# EAGLE design Iridium_9603_Beacon (EAGLE 9.2.2)

## Sheet 1 of 8
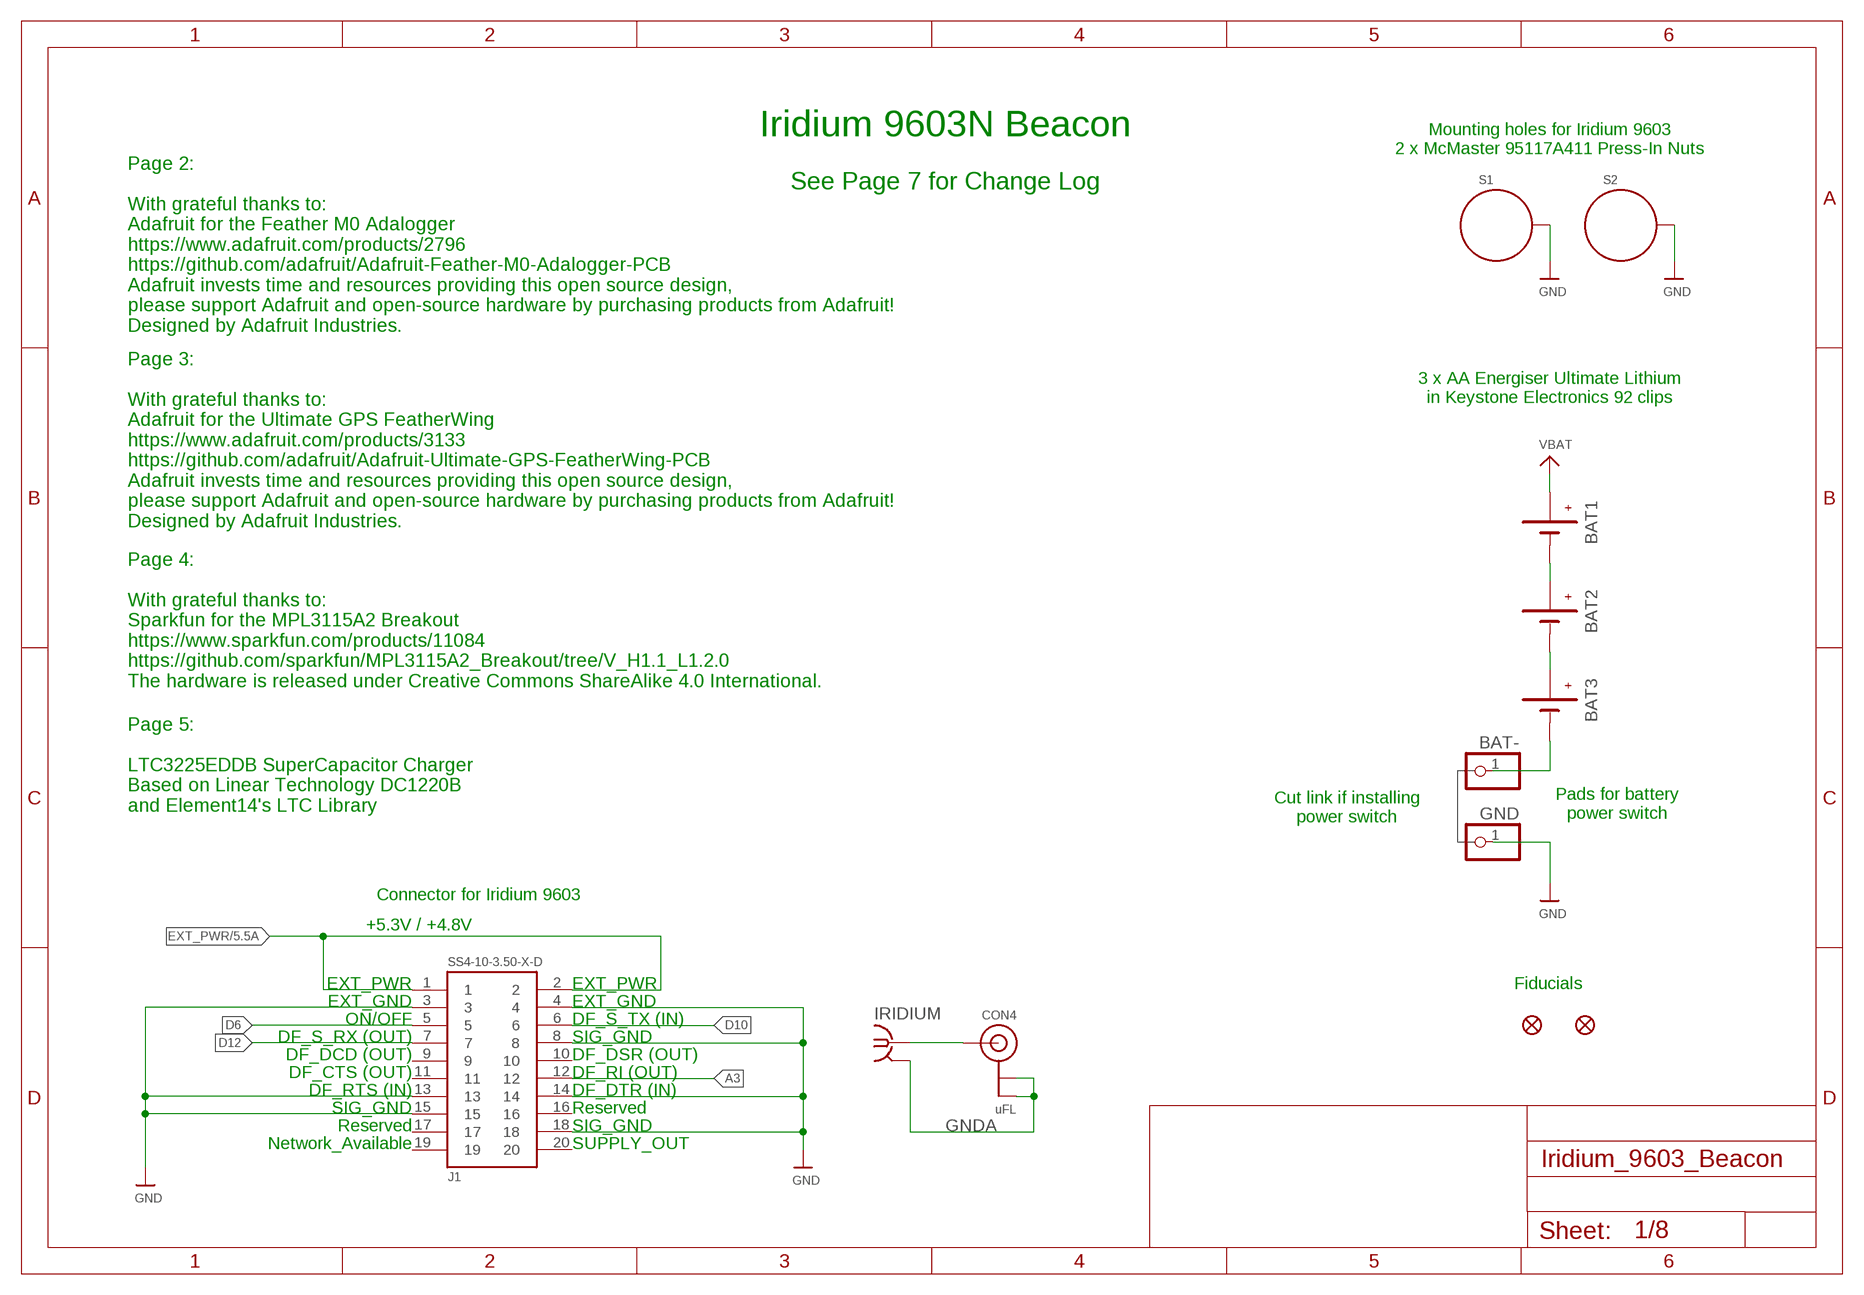
[diagram p0: schematic, sheet 1]

### Parts
BAT1  BATTERYKEYSTONE92  [BATTERY-AAA-KEYSTONE92]
BAT2  BATTERYKEYSTONE92  [BATTERY-AAA-KEYSTONE92]
BAT3  BATTERYKEYSTONE92  [BATTERY-AAA-KEYSTONE92]
BAT-  PINHD-1X1  [1X01]
CON4  uFL  ANTENNA_U.FL  [U.FL]
FD1  FIDUCIAL1X2  [FIDUCIAL-1X2]
FD2  FIDUCIAL1X2  [FIDUCIAL-1X2]
GND  PINHD-1X1  [1X01]
IRIDIUM  SMA-142-0711-821/826  [J502-ND-142-0711-821/826]
J1  SS4-10-3.50-X-D  [SS4-10-3.50-X-D]
S1  STANDOFF_ELECTRICALMCMASTER-95117A411  [STANDOFF-ELECTRICAL-MCMASTER-95117A411]
S2  STANDOFF_ELECTRICALMCMASTER-95117A411  [STANDOFF-ELECTRICAL-MCMASTER-95117A411]

### Nets
A3: J1.12 ; also sheet 2
D6: J1.5 ; also sheet 2
D10: J1.6 ; also sheet 2
D12: J1.7 ; also sheet 2
EXT_PWR: J1.1 J1.2 ; also sheet 5
GND: GND.1 J1.3 J1.4 J1.8 J1.13 J1.14 J1.15 J1.18 S1.P1 S2.P1 ; also sheet 2,3,4,5,6
GNDA: CON4.1(GND) CON4.2(GND) IRIDIUM.G@1 IRIDIUM.G@2 IRIDIUM.G@3 IRIDIUM.G@4
N$2: CON4.3(SIGNAL) IRIDIUM.1
N$8: BAT1.GND@1(-) BAT1.GND@2(-) BAT2.PWR@1(+) BAT2.PWR@2(+)
N$15: BAT3.GND@1(-) BAT3.GND@2(-) BAT-.1
N$21: BAT2.GND@1(-) BAT2.GND@2(-) BAT3.PWR@1(+) BAT3.PWR@2(+)
VBAT: BAT1.PWR@1(+) BAT1.PWR@2(+) ; also sheet 2
Unconnected: J1.9 J1.10 J1.11 J1.16 J1.17 J1.19 J1.20

### Notes on the sheet
- Iridium 9603N Beacon
- Mounting holes for Iridium 9603
  2 x McMaster 95117A411 Press-In Nuts
- See Page 7 for Change Log
- Page 2:
  
  With grateful thanks to:
  Adafruit for the Feather M0 Adalogger
  https://www.adafruit.com/products/2796
  https://github.com/adafruit/Adafruit-Feather-M0-Adalogger-PCB
  Adafruit invests time and resources providing this open source design,
  please support Adafruit and open-source hardware by purchasing products from Adafruit!
  Designed by Adafruit Industries.
- 3 x AA Energiser Ultimate Lithium
  in Keystone Electronics 92 clips
- Page 3:
  
  With grateful thanks to:
  Adafruit for the Ultimate GPS FeatherWing
  https://www.adafruit.com/products/3133
  https://github.com/adafruit/Adafruit-Ultimate-GPS-FeatherWing-PCB
  Adafruit invests time and resources providing this open source design,
  please support Adafruit and open-source hardware by purchasing products from Adafruit!
  Designed by Adafruit Industries.
- Page 4:
  
  With grateful thanks to:
  Sparkfun for the MPL3115A2 Breakout
  https://www.sparkfun.com/products/11084
  https://github.com/sparkfun/MPL3115A2_Breakout/tree/V_H1.1_L1.2.0
  The hardware is released under Creative Commons ShareAlike 4.0 International.
- Page 5:
  
  LTC3225EDDB SuperCapacitor Charger
  Based on Linear Technology DC1220B
  and Element14's LTC Library
- Pads for battery
  power switch
- Cut link if installing
  power switch
- Connector for Iridium 9603
- +5.3V / +4.8V
- EXT_PWR | EXT_PWR | Fiducials
- EXT_GND | EXT_GND
- ON/OFF | DF_S_TX (IN)
- DF_S_RX (OUT) | SIG_GND
- DF_DCD (OUT) | DF_DSR (OUT)
- DF_CTS (OUT) | DF_RI (OUT)
- DF_RTS (IN) | DF_DTR (IN)
- SIG_GND | Reserved
- Reserved | SIG_GND
- Network_Available | SUPPLY_OUT

## Sheet 2 of 8
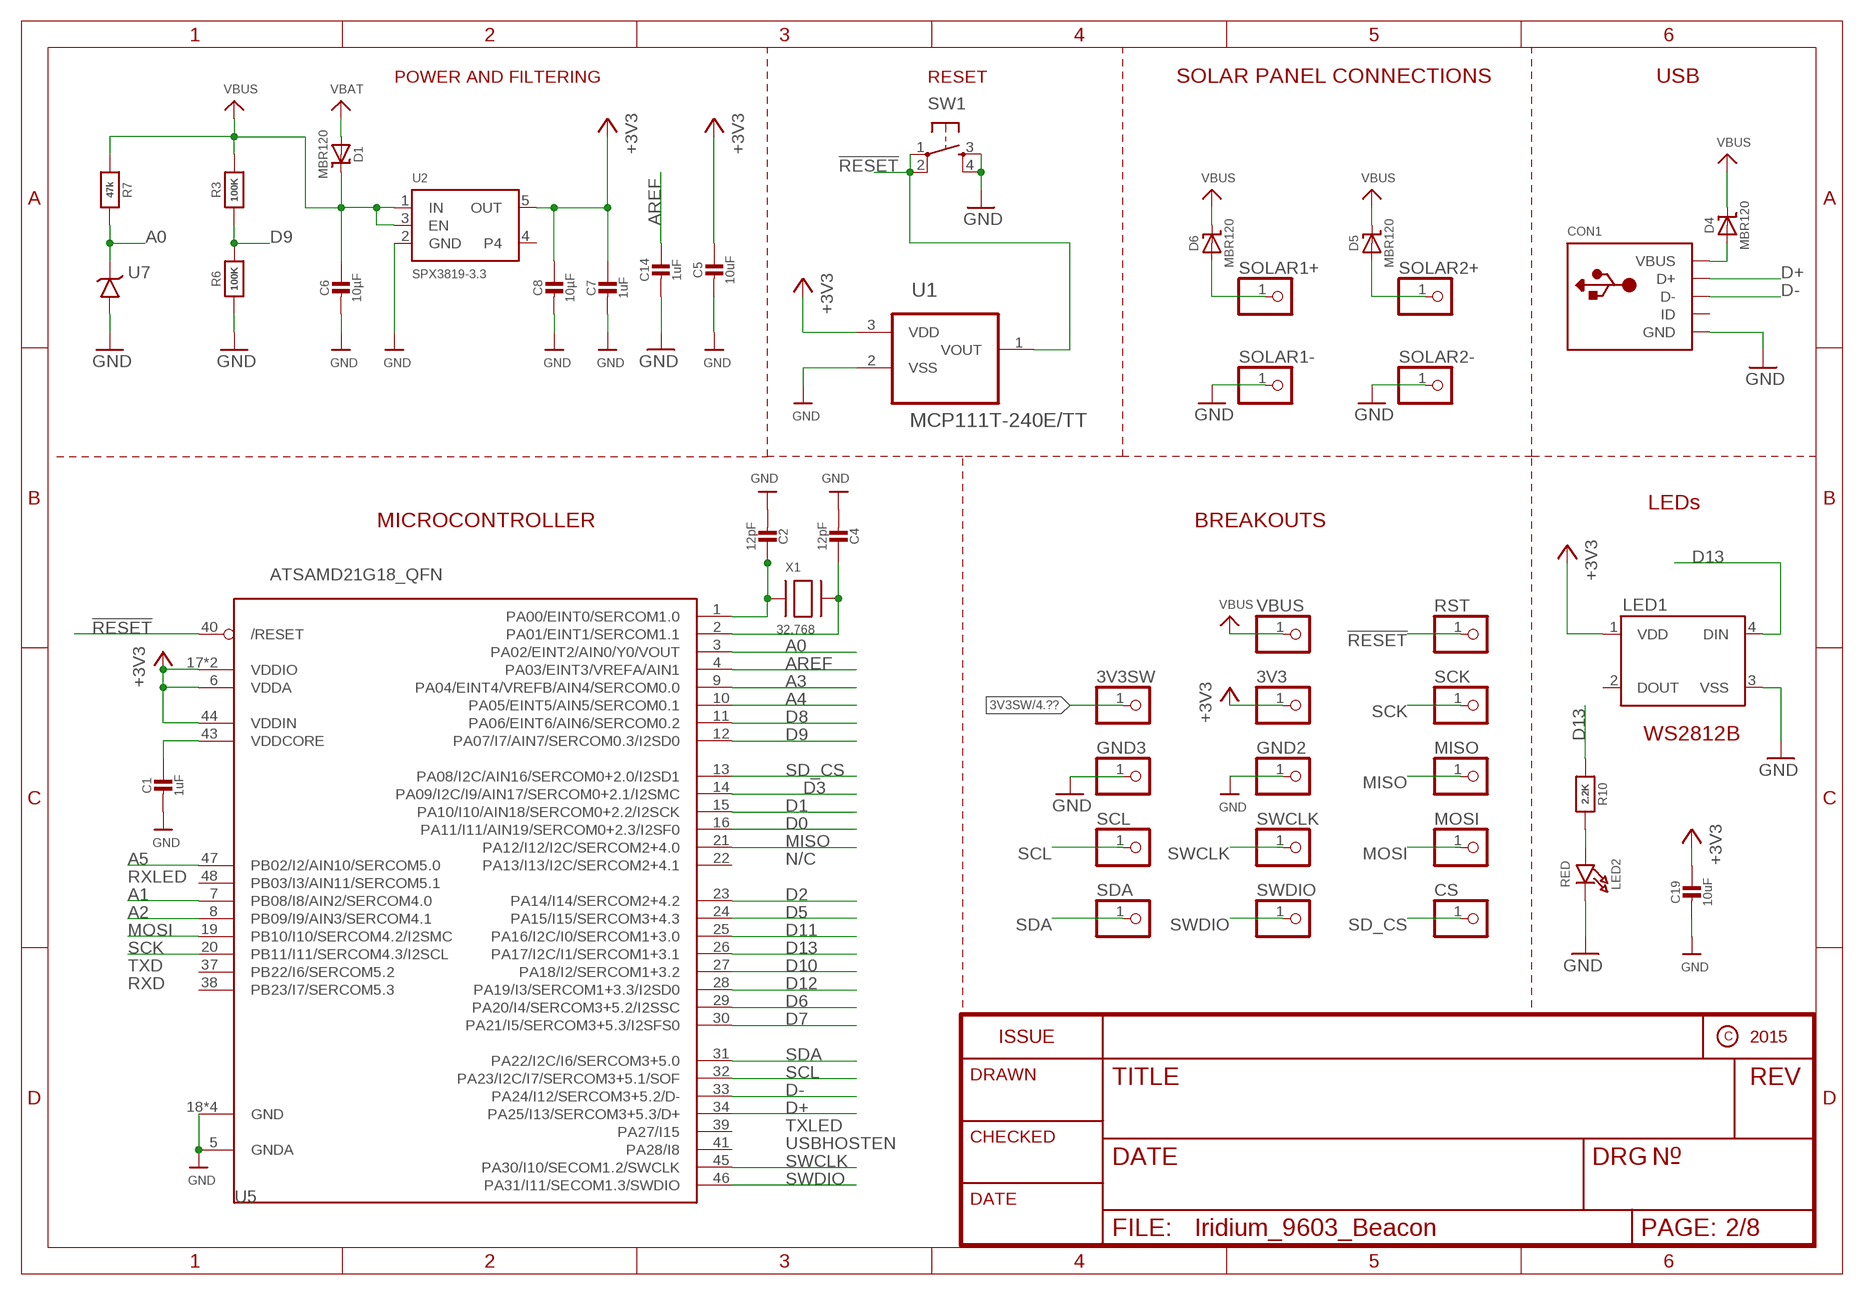
[diagram p1: schematic, sheet 2]

### Parts
3V3  PINHD-1X1  [1X01]
3V3SW  PINHD-1X1  [1X01]
C1  1uF  CAP_CERAMIC0603_NO  [0603-NO]
C2  12pF  CAP_CERAMIC0603_NO  [0603-NO]
C4  12pF  CAP_CERAMIC0603_NO  [0603-NO]
C5  10uF  CAP_CERAMIC0805-NOOUTLINE  [0805-NO]
C6  10µF  CAP_CERAMIC0805-NOOUTLINE  [0805-NO]
C7  1uF  CAP_CERAMIC0603_NO  [0603-NO]
C8  10µF  CAP_CERAMIC0805-NOOUTLINE  [0805-NO]
C14  1uF  CAP_CERAMIC0603_NO  [0603-NO]
C19  10uF  CAP_CERAMIC0805-NOOUTLINE  [0805-NO]
CON1  MICROBUILDER_USBFCI_10103594_CORRECTED  [MICROBUILDER_FCI_10103594_CORRECTED]
CS  PINHD-1X1  [1X01]
D1  MBR120  DIODE-SCHOTTKYSOD-123  [SOD-123]
D4  MBR120  DIODE-SCHOTTKYSOD-123  [SOD-123]
D5  MBR120  DIODE-SCHOTTKYSOD-123  [SOD-123]
D6  MBR120  DIODE-SCHOTTKYSOD-123  [SOD-123]
GND2  PINHD-1X1  [1X01]
GND3  PINHD-1X1  [1X01]
LED1  WS2812B  [WS2812B]
LED2  RED  LED0805_NOOUTLINE  [CHIPLED_0805_NOOUTLINE]
MISO  PINHD-1X1  [1X01]
MOSI  PINHD-1X1  [1X01]
R3  100K  RESISTOR0805_NOOUTLINE  [0805-NO]
R6  100K  RESISTOR0805_NOOUTLINE  [0805-NO]
R7  47k  RESISTOR_0603_NOOUT  [0603-NO]
R10  2.2K  RESISTOR_0603_NOOUT  [0603-NO]
RST  PINHD-1X1  [1X01]
SCK  PINHD-1X1  [1X01]
SCL  PINHD-1X1  [1X01]
SDA  PINHD-1X1  [1X01]
SOLAR1+  PINHD-1X1  [1X01]
SOLAR1-  PINHD-1X1  [1X01]
SOLAR2+  PINHD-1X1  [1X01]
SOLAR2-  PINHD-1X1  [1X01]
SW1  SWITCH_SPST_4_PINRECT  [TACTILE_SWITCH_SMD_4.6X2.8MM]
SWCLK  PINHD-1X1  [1X01]
SWDIO  PINHD-1X1  [1X01]
U1  MCP111T-240E/TT  MCP111T-270E/TT  [SOT95P237X112-3N]
U2  SPX3819-3.3  VREG_SOT23-5  [SOT23-5]
U5  ATSAMD21G18_QFN  ATSAMD21J_QFN  [TQFN48_7MM]
U7  LT1634-1,25BMCMS8  [MSOP8]
VBUS  PINHD-1X1  [1X01]
X1  32.768  XTAL-3.2X1.5  [XTAL3215]

### Nets
3V3SW: 3V3SW.1 ; also sheet 3,4
!RESET: RST.1 SW1.1 SW1.2 U1.1(VOUT) U5.40(/RESET)
+3V3: 3V3.1 C5.1 C7.1 C8.1 C19.1 LED1.1(VDD) U1.3(VDD) U2.5(OUT) U5.6(VDDA) U5.17(VDDIO) U5.36(VDDIO) U5.44(VDDIN) ; also sheet 3,4,5,6
A0: R7.2 U5.3(PA02/EINT2/AIN0/Y0/VOUT) U7.6(VOUT)
A1: U5.7(PB08/I8/AIN2/SERCOM4.0) ; also sheet 5
A2: U5.8(PB09/I9/AIN3/SERCOM4.1)
A3: U5.9(PA04/EINT4/VREFB/AIN4/SERCOM0.0) ; also sheet 1
A4: U5.10(PA05/EINT5/AIN5/SERCOM0.1)
A5: U5.47(PB02/I2/AIN10/SERCOM5.0) ; also sheet 5
AREF: C14.1 U5.4(PA03/EINT3/VREFA/AIN1)
D0: U5.16(PA11/I11/AIN19/SERCOM0+2.3/I2SF0) ; also sheet 3
D1: U5.15(PA10/I10/AIN18/SERCOM0+2.2/I2SCK) ; also sheet 3
D2: U5.23(PA14/I14/SERCOM2+4.2) ; also sheet 6
D3: U5.14(PA09/I2C/I9/AIN17/SERCOM0+2.1/I2SMC)
D5: U5.24(PA15/I15/SERCOM3+4.3) ; also sheet 5
D6: U5.29(PA20/I4/SERCOM3+5.2/I2SSC) ; also sheet 1
D7: U5.30(PA21/I5/SERCOM3+5.3/I2SFS0) ; also sheet 6
D8: U5.11(PA06/EINT6/AIN6/SERCOM0.2)
D9: R3.1 R6.2 U5.12(PA07/I7/AIN7/SERCOM0.3/I2SD0)
D10: U5.27(PA18/I2/SERCOM1+3.2) ; also sheet 1
D11: U5.25(PA16/I2C/I0/SERCOM1+3.0) ; also sheet 3
D12: U5.28(PA19/I3/SERCOM1+3.3/I2SD0) ; also sheet 1
D13: LED1.4(DIN) R10.1 U5.26(PA17/I2C/I1/SERCOM1+3.1)
D+: CON1.D+ U5.34(PA25/I13/SERCOM3+5.3/D+)
D-: CON1.D- U5.33(PA24/I12/SERCOM3+5.2/D-)
GND: C1.2 C2.2 C4.2 C5.2 C6.2 C7.2 C8.2 C14.2 C19.2 CON1.BASE@1(GND) CON1.BASE@2(GND) CON1.GND CON1.SPRT@1(GND) CON1.SPRT@2(GND) CON1.SPRT@3(GND) CON1.SPRT@4(GND) GND2.1 GND3.1 LED1.3(VSS) LED2.C R6.1 SOLAR1-.1 SOLAR2-.1 SW1.3 SW1.4 U1.2(VSS) U2.2(GND) U5.5(GNDA) U5.18(GND) U5.35(GND) U5.42(GND) U5.THERMAL(GND) U7.4(GND) ; also sheet 1,3,4,5,6
MISO: MISO.1 U5.21(PA12/I12/I2C/SERCOM2+4.0)
MOSI: MOSI.1 U5.19(PB10/I10/SERCOM4.2/I2SMC)
N$3: LED2.A R10.2
N$4: D6.A SOLAR1+.1
N$5: C2.1 U5.1(PA00/EINT0/SERCOM1.0) X1.P$1
N$7: C4.1 U5.2(PA01/EINT1/SERCOM1.1) X1.P$2
N$14: D5.A SOLAR2+.1
N$16: CON1.VBUS D4.A
SCK: SCK.1 U5.20(PB11/I11/SERCOM4.3/I2SCL)
SCL: SCL.1 U5.32(PA23/I2C/I7/SERCOM3+5.1/SOF) ; also sheet 4
SD_CS: CS.1 U5.13(PA08/I2C/AIN16/SERCOM0+2.0/I2SD1)
SDA: SDA.1 U5.31(PA22/I2C/I6/SERCOM3+5.0) ; also sheet 4
SWCLK: SWCLK.1 U5.45(PA30/I10/SECOM1.2/SWCLK)
SWDIO: SWDIO.1 U5.46(PA31/I11/SECOM1.3/SWDIO)
VBAT: D1.A ; also sheet 1
VBUS: C6.1 D1.C D4.C D5.C D6.C R3.2 R7.1 U2.1(IN) U2.3(EN) VBUS.1 ; also sheet 5
VDDCORE1: C1.1 U5.43(VDDCORE)
Unconnected: CON1.ID LED1.2(DOUT) U2.4 U5.22(PA13/I13/I2C/SERCOM2+4.1) U5.37(PB22/I6/SERCOM5.2) U5.38(PB23/I7/SERCOM5.3) U5.39(PA27/I15) U5.41(PA28/I8) U5.48(PB03/I3/AIN11/SERCOM5.1)

### Notes on the sheet
- POWER AND FILTERING | RESET | SOLAR PANEL CONNECTIONS | USB
- LEDs
- MICROCONTROLLER | BREAKOUTS
- WS2812B
- N/C
- RXLED
- TXD
- RXD
- TXLED
- USBHOSTEN

## Sheet 3 of 8
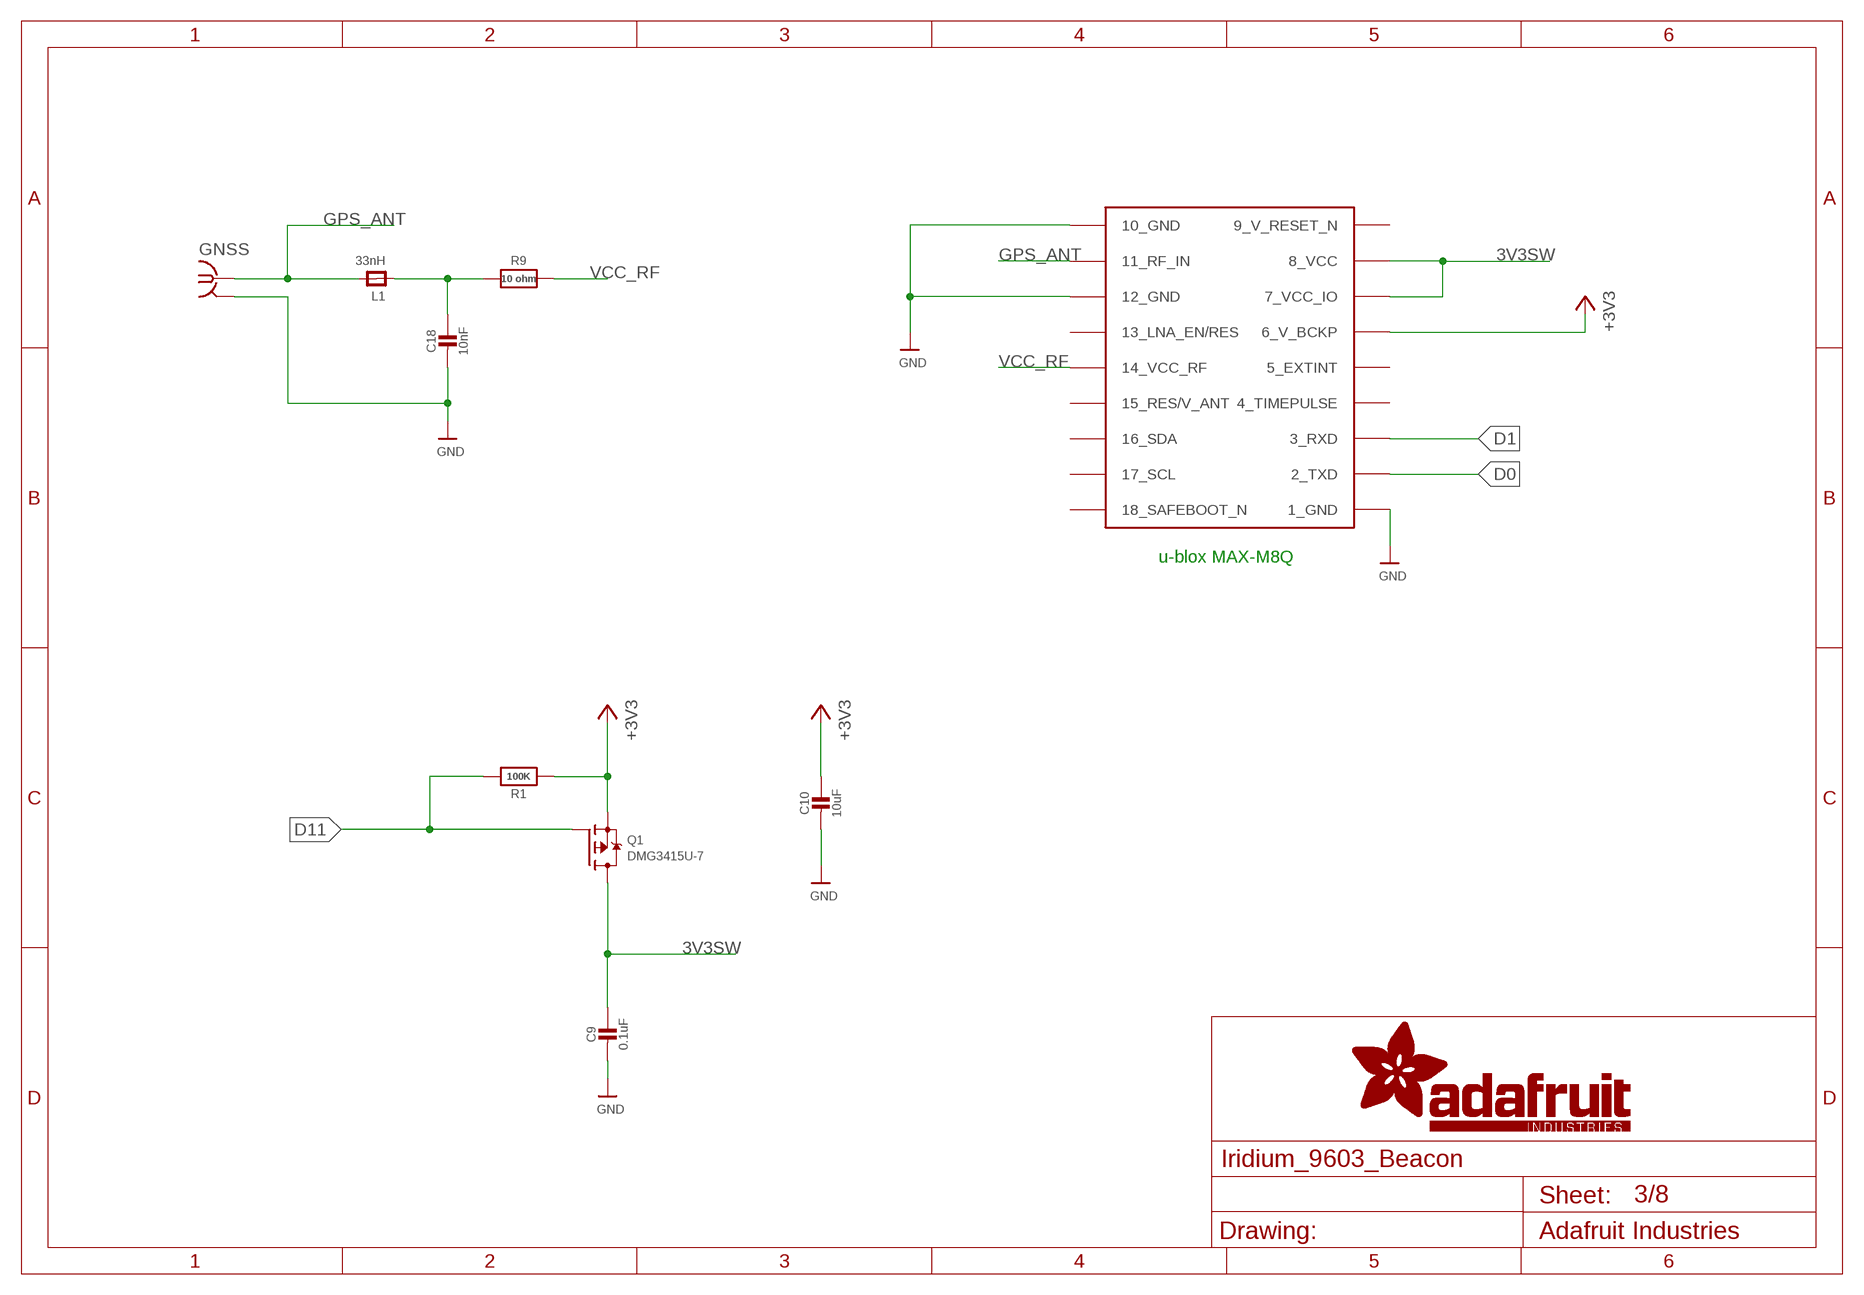
[diagram p2: schematic, sheet 3]

### Parts
C9  0.1uF  CAP_CERAMIC0805-NOOUTLINE  [0805-NO]
C10  10uF  CAP_CERAMIC0805-NOOUTLINE  [0805-NO]
C18  10nF  CAP_CERAMIC0805-NOOUTLINE  [0805-NO]
GNSS  SMA-142-0711-821/826  [J502-ND-142-0711-821/826]
L1  33nH  FERRITE-0805NO  [0805-NO]
Q1  DMG3415U-7  MOSFET-PWIDE  [SOT23-WIDE]
R1  100K  RESISTOR0805_NOOUTLINE  [0805-NO]
R9  10 ohm  RESISTOR0805_NOOUTLINE  [0805-NO]
U6  MAX-M8  [MAX-M8]

### Nets
3V3SW: C9.1 Q1.3(D) U6.7_VCC_IO U6.8_VCC ; also sheet 2,4
+3V3: C10.1 Q1.2(S) R1.1 U6.6_V_BCKP ; also sheet 2,4,5,6
D0: U6.2_TXD ; also sheet 2
D1: U6.3_RXD ; also sheet 2
D11: Q1.1(G) R1.2 ; also sheet 2
GND: C9.2 C10.2 C18.2 GNSS.G@1 GNSS.G@2 GNSS.G@3 GNSS.G@4 U6.1_GND U6.10_GND U6.12_GND ; also sheet 1,2,4,5,6
GPS_ANT: GNSS.1 L1.2 U6.11_RF_IN
N$1: C18.1 L1.1 R9.1
VCC_RF: R9.2 U6.14_VCC_RF
Unconnected: U6.4_TIMEPULSE U6.5_EXTINT U6.13_LNA_EN(13_LNA_EN/RES) U6.15_V_ANT/RESERVED(15_RES/V_ANT) U6.16_SDA U6.17_SCL U6.18_SAFEBOOT_N

### Notes on the sheet
- u-blox MAX-M8Q

## Sheet 4 of 8
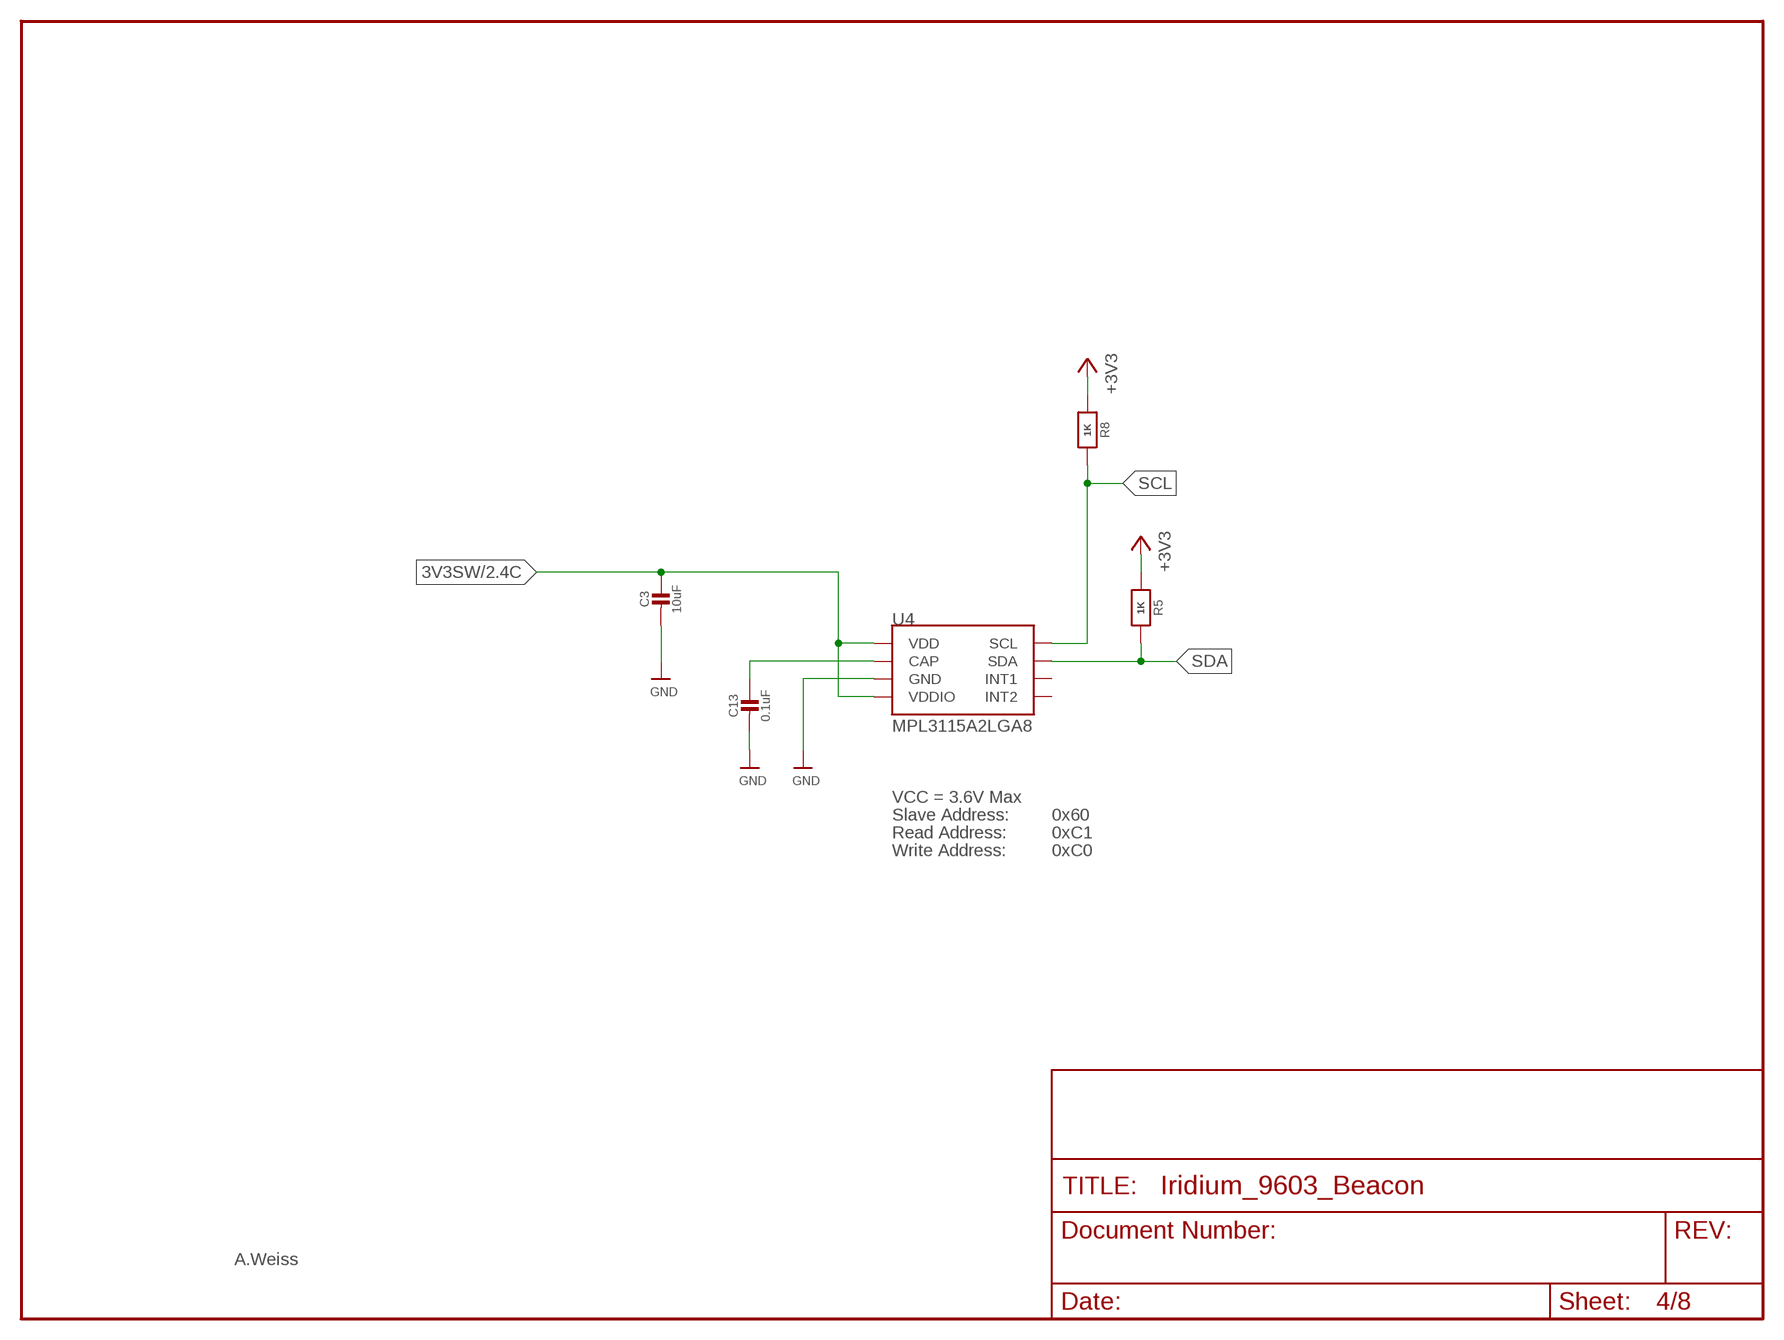
[diagram p3: schematic, sheet 4]

### Parts
C3  10uF  CAP_CERAMIC0805-NOOUTLINE  [0805-NO]
C13  0.1uF  CAP_CERAMIC0805-NOOUTLINE  [0805-NO]
R5  1K  RESISTOR_0603_NOOUT  [0603-NO]
R8  1K  RESISTOR_0603_NOOUT  [0603-NO]
U4  MPL3115A2LGA8  [LGA8]

### Nets
3V3SW: C3.1 U4.1(VDD) U4.4(VDDIO) ; also sheet 2,3
+3V3: R5.1 R8.1 ; also sheet 2,3,5,6
GND: C3.2 C13.2 U4.3(GND) ; also sheet 1,2,3,5,6
N$12: C13.1 U4.2(CAP)
SCL: R8.2 U4.8(SCL) ; also sheet 2
SDA: R5.2 U4.7(SDA) ; also sheet 2
Unconnected: U4.5(INT2) U4.6(INT1)

### Notes on the sheet
- VCC = 3.6V Max
- Slave Address: | 0x60
- Read Address: | 0xC1
- Write Address: | 0xC0
- A.Weiss

## Sheet 5 of 8
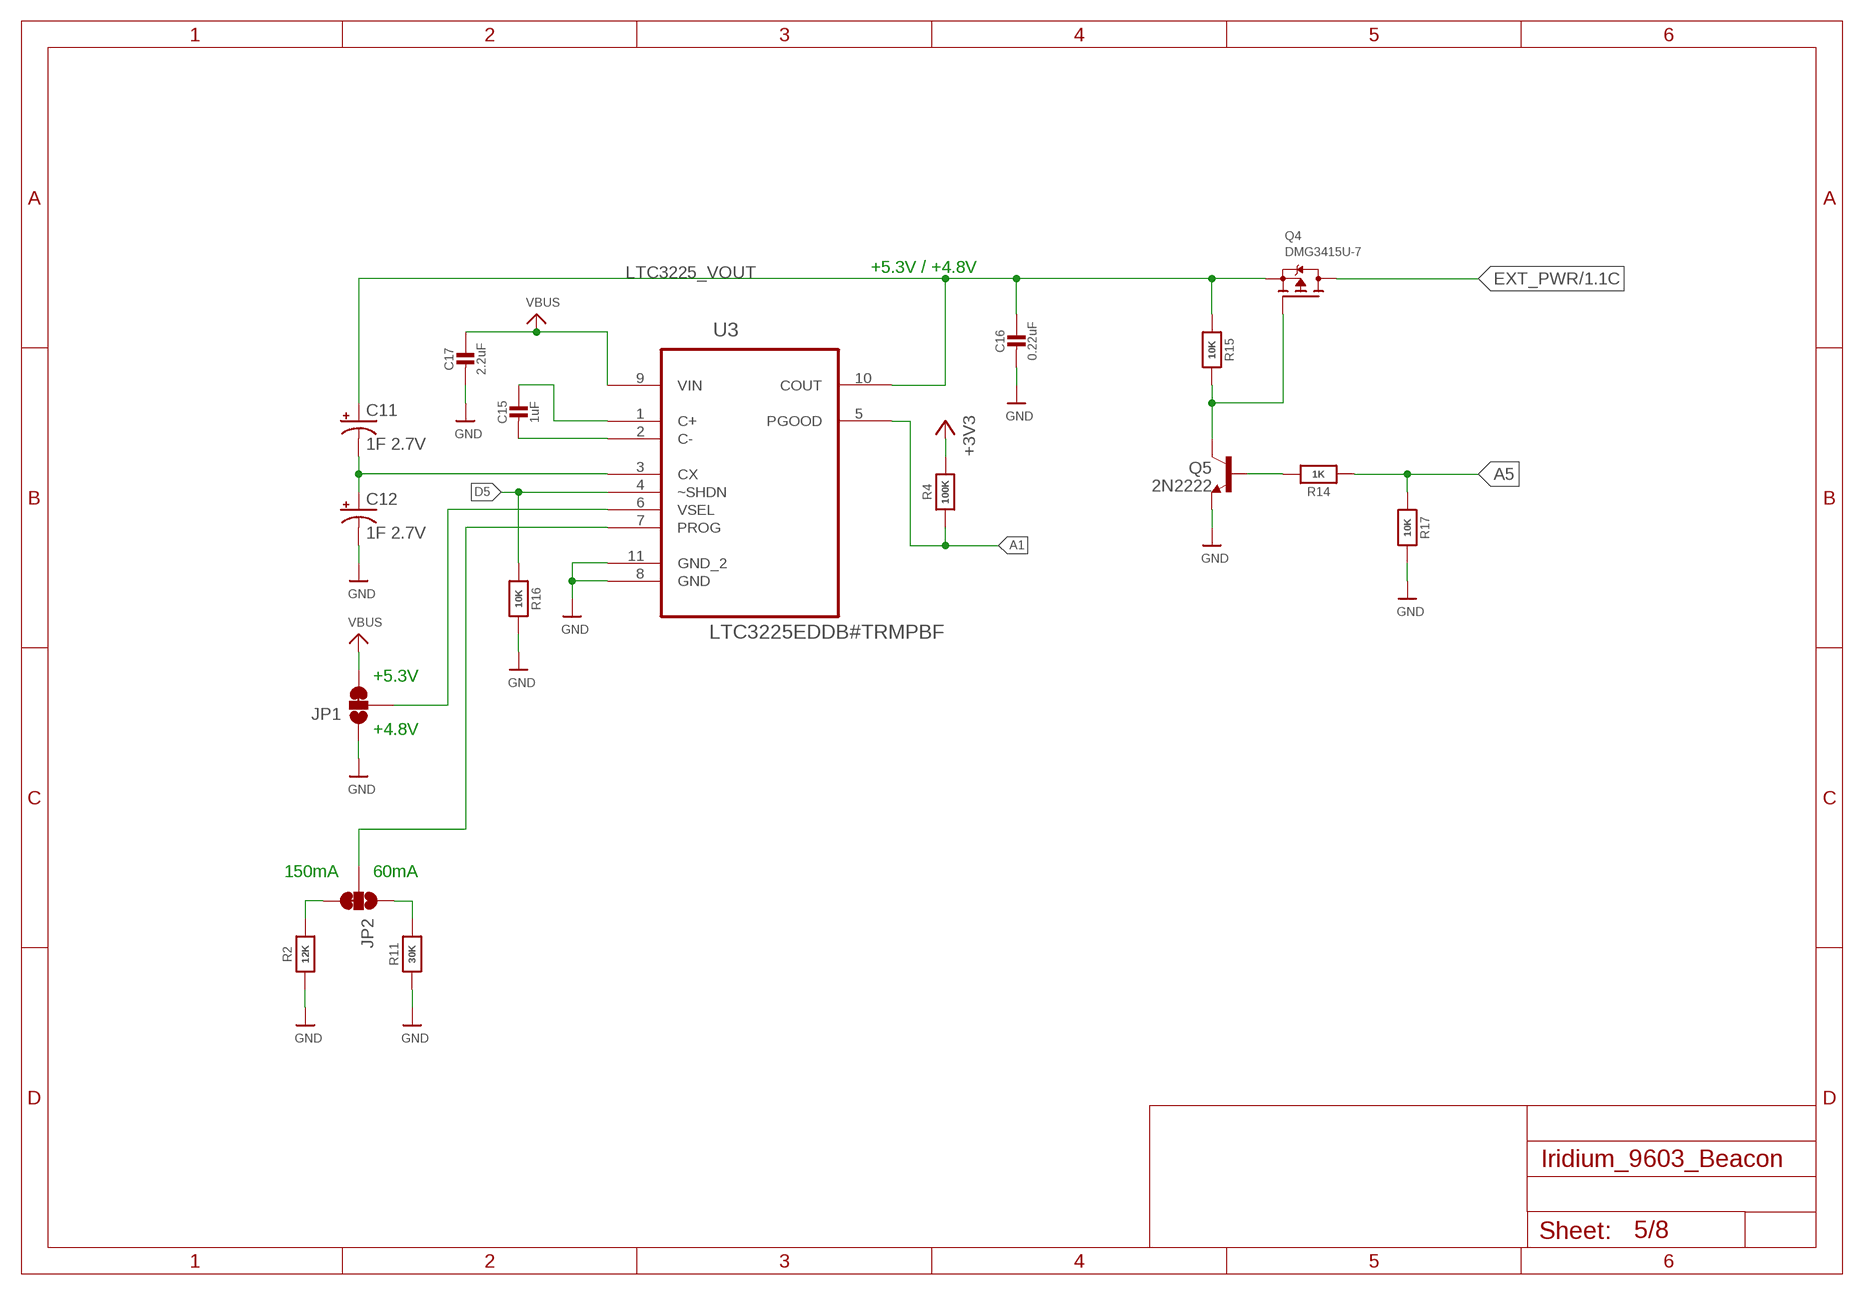
[diagram p4: schematic, sheet 5]

### Parts
C11  1F 2.7V  1F-2.7V(PTH)CPOL-RADIAL-1H-2.7V  [CPOL-RADIAL-1F-2.7V]
C12  1F 2.7V  1F-2.7V(PTH)CPOL-RADIAL-1H-2.7V  [CPOL-RADIAL-1F-2.7V]
C15  1uF  CAP_CERAMIC0603_NO  [0603-NO]
C16  0.22uF  CAP_CERAMIC0603_NO  [0603-NO]
C17  2.2uF  CAP_CERAMIC0805-NOOUTLINE  [0805-NO]
JP1  JUMPER-PAD-3-2OF3_NC_BY_TRACE_LARGE  [PAD-JUMPER-3-2OF3_NC_BY_TRACE_YES_SILK_LARGE]
JP2  JUMPER-PAD-3-2OF3_NC_BY_TRACE_LARGE  [PAD-JUMPER-3-2OF3_NC_BY_TRACE_YES_SILK_LARGE]
Q4  DMG3415U-7  MOSFET-PWIDE  [SOT23-WIDE]
Q5  2N2222  MMBT2222ALT1-NPN-SOT23-BEC  [SOT23-BEC]
R2  12K  RESISTOR0805_NOOUTLINE  [0805-NO]
R4  100K  RESISTOR0805_NOOUTLINE  [0805-NO]
R11  30K  RESISTOR0805_NOOUTLINE  [0805-NO]
R14  1K  RESISTOR_0603_NOOUT  [0603-NO]
R15  10K  RESISTOR_0603_NOOUT  [0603-NO]
R16  10K  RESISTOR_0603_NOOUT  [0603-NO]
R17  10K  RESISTOR_0603_NOOUT  [0603-NO]
U3  LTC3225EDDB#TRMPBF  LTC3225EDDB-TRMPBFDFN300X200-10L  [DFN300X200-10L]

### Nets
+3V3: R4.2 ; also sheet 2,3,4,6
A1: R4.1 U3.5(PGOOD) ; also sheet 2
A5: R14.1 R17.1 ; also sheet 2
D5: R16.1 U3.4(~SHDN) ; also sheet 2
EXT_PWR: Q4.3(D) ; also sheet 1
GND: C12.- C16.2 C17.2 JP1.1 Q5.E R2.1 R11.1 R16.2 R17.2 U3.8(GND) U3.11(GND_2) ; also sheet 1,2,3,4,6
LTC3225_VOUT: C11.+ C16.1 Q4.2(S) R15.1 U3.10(COUT)
N$6: C11.- C12.+ U3.3(CX)
N$9: C15.2 U3.2(C-)
N$10: C15.1 U3.1(C+)
N$11: JP2.2 U3.7(PROG)
N$13: JP1.2 U3.6(VSEL)
N$17: JP2.3 R2.2
N$18: JP2.1 R11.2
N$19: Q4.1(G) Q5.C R15.2
N$20: Q5.B R14.2
VBUS: C17.1 JP1.3 U3.9(VIN) ; also sheet 2

### Notes on the sheet
- +5.3V / +4.8V
- +5.3V
- +4.8V
- 150mA | 60mA

## Sheet 6 of 8
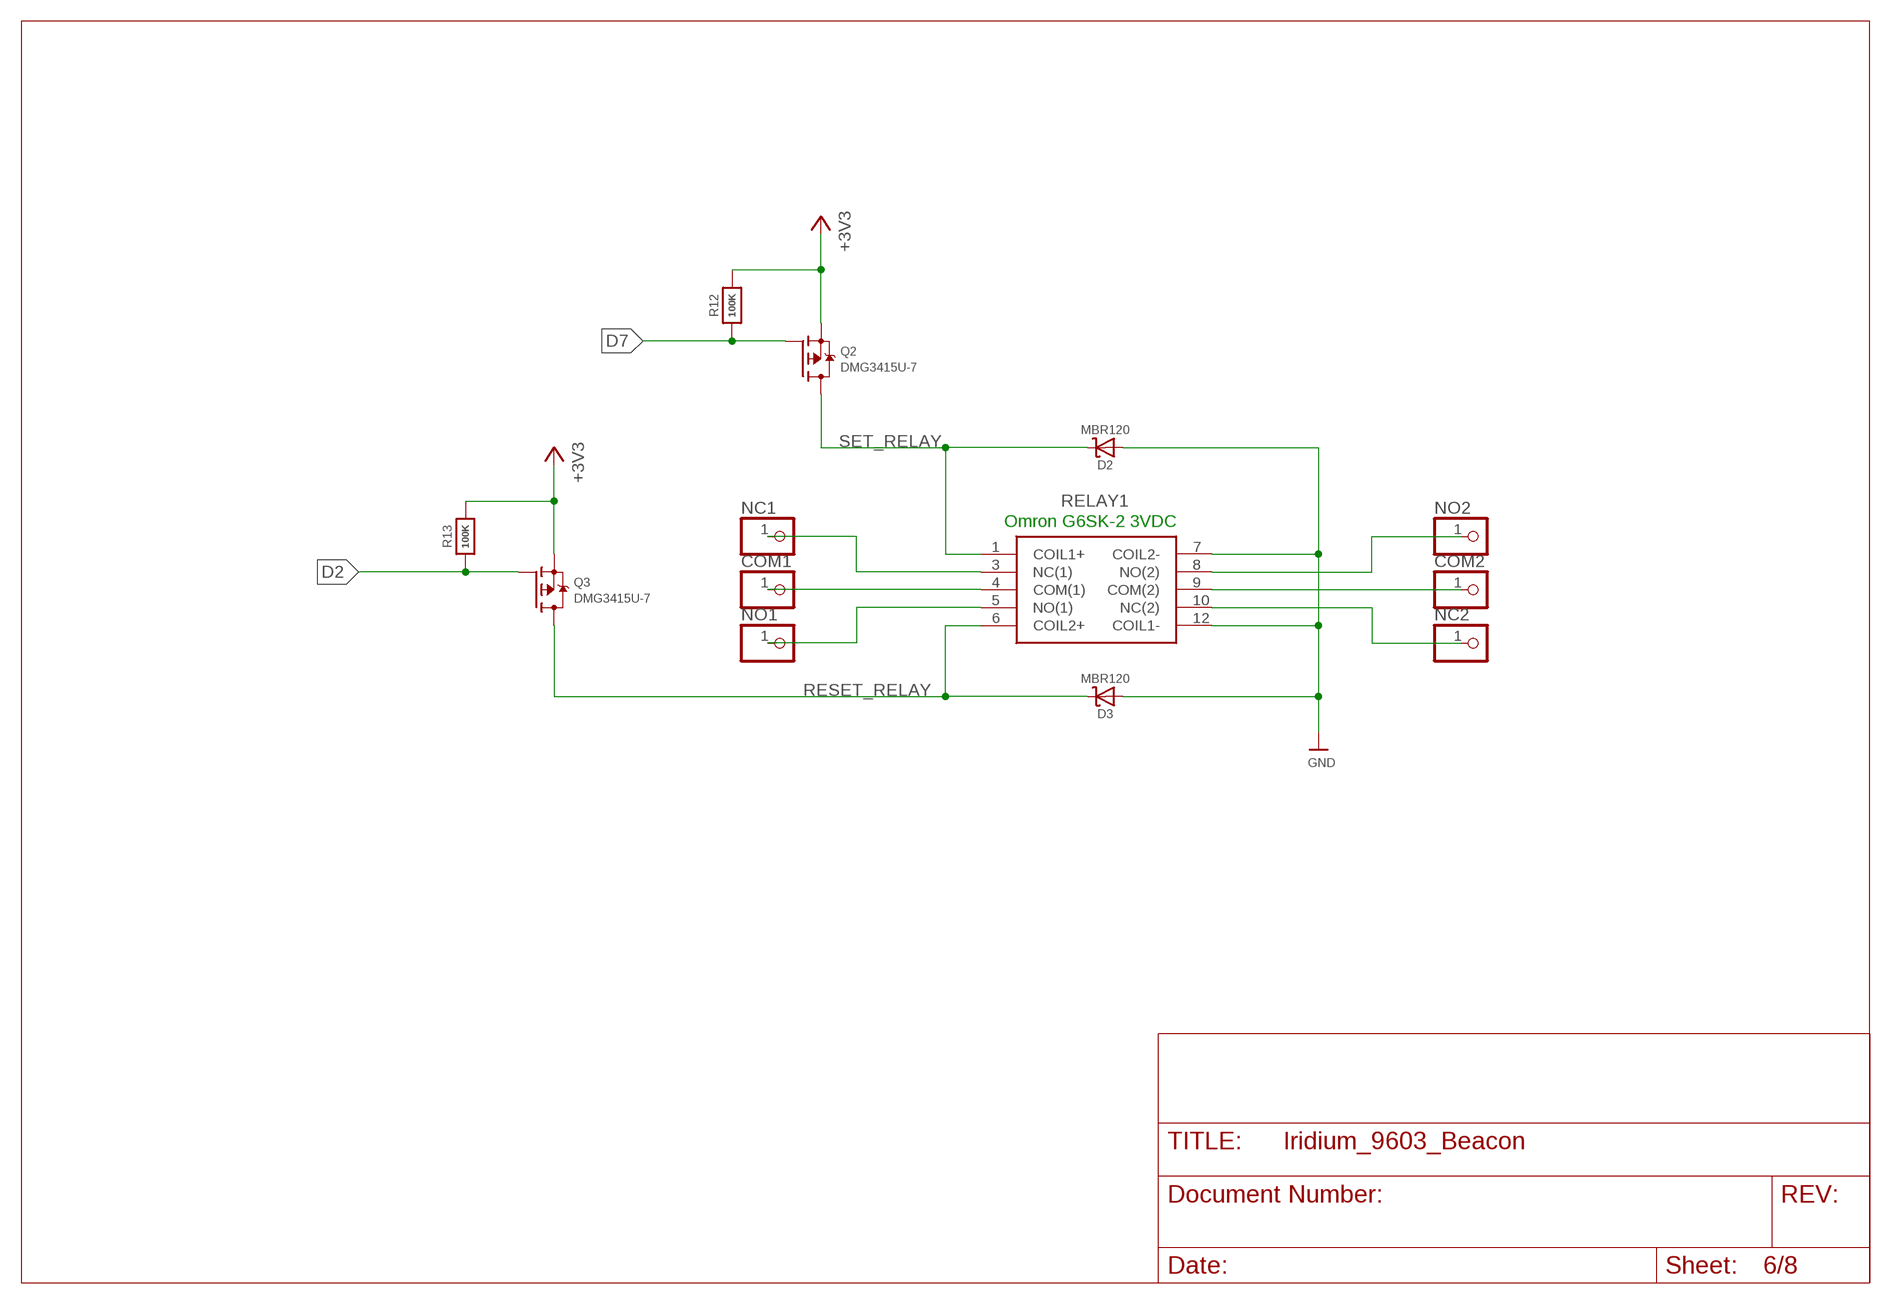
[diagram p5: schematic, sheet 6]

### Parts
COM1  PINHD-1X1  [1X01]
COM2  PINHD-1X1  [1X01]
D2  MBR120  DIODE-SCHOTTKYSOD-123  [SOD-123]
D3  MBR120  DIODE-SCHOTTKYSOD-123  [SOD-123]
NC1  PINHD-1X1  [1X01]
NC2  PINHD-1X1  [1X01]
NO1  PINHD-1X1  [1X01]
NO2  PINHD-1X1  [1X01]
Q2  DMG3415U-7  MOSFET-PWIDE  [SOT23-WIDE]
Q3  DMG3415U-7  MOSFET-PWIDE  [SOT23-WIDE]
R12  100K  RESISTOR0805_NOOUTLINE  [0805-NO]
R13  100K  RESISTOR0805_NOOUTLINE  [0805-NO]
RELAY1  G6SK-2_DC5  [G6SK2DC5]

### Nets
+3V3: Q2.2(S) Q3.2(S) R12.2 R13.2 ; also sheet 2,3,4,5
D2: Q3.1(G) R13.1 ; also sheet 2
D7: Q2.1(G) R12.1 ; also sheet 2
GND: D2.A D3.A RELAY1.7(COIL2-) RELAY1.12(COIL1-) ; also sheet 1,2,3,4,5
N$23: NC1.1 RELAY1.3(NC(1))
N$24: COM1.1 RELAY1.4(COM(1))
N$25: NO1.1 RELAY1.5(NO(1))
N$26: NO2.1 RELAY1.8(NO(2))
N$27: COM2.1 RELAY1.9(COM(2))
N$28: NC2.1 RELAY1.10(NC(2))
RESET_RELAY: D3.C Q3.3(D) RELAY1.6(COIL2+)
SET_RELAY: D2.C Q2.3(D) RELAY1.1(COIL1+)

### Notes on the sheet
- Omron G6SK-2 3VDC

## Sheet 7 of 8
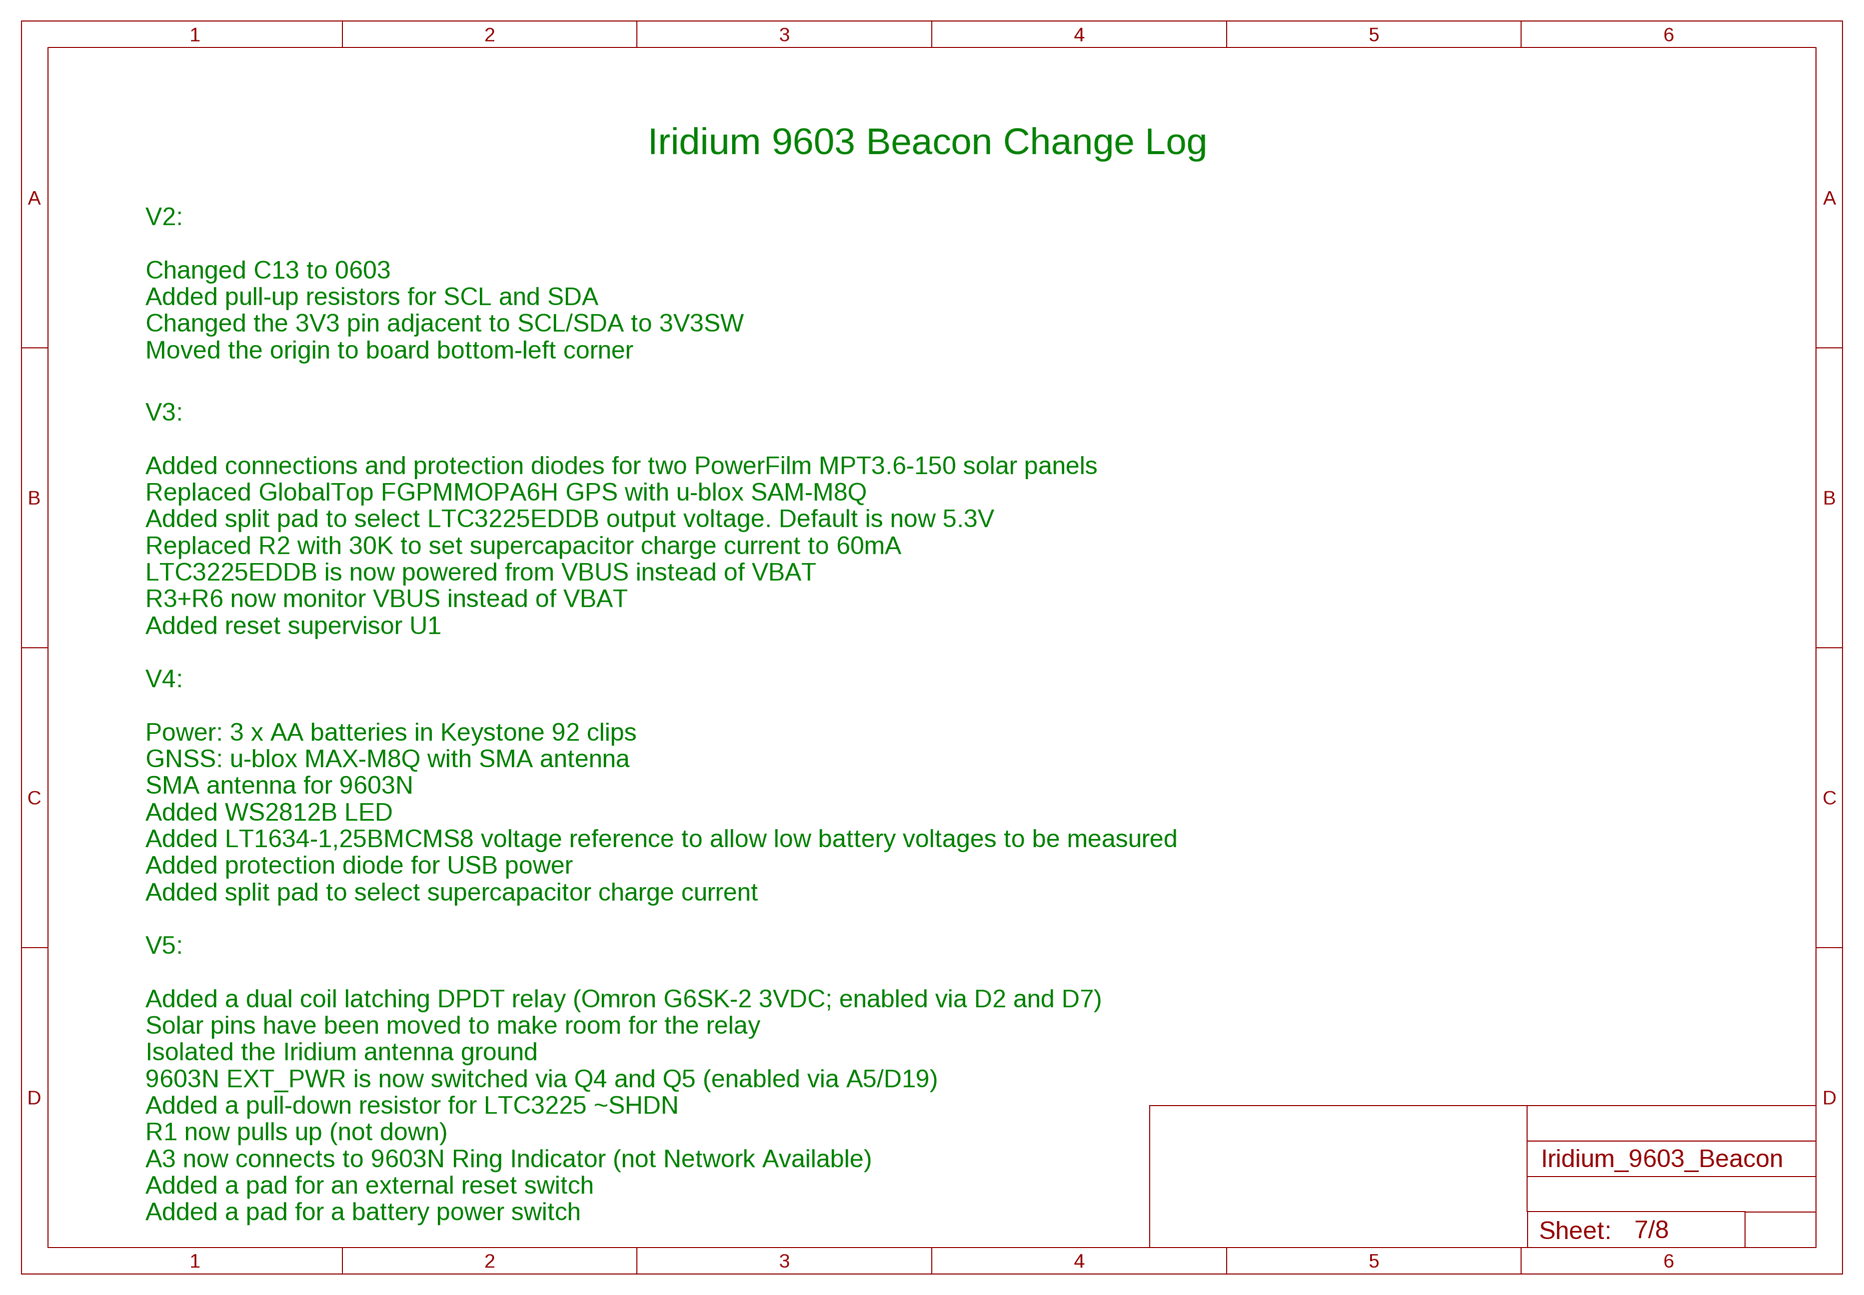
[diagram p6: schematic, sheet 7]

### Notes on the sheet
- Iridium 9603 Beacon Change Log
- V2:
  
  Changed C13 to 0603
  Added pull-up resistors for SCL and SDA
  Changed the 3V3 pin adjacent to SCL/SDA to 3V3SW
  Moved the origin to board bottom-left corner
- V3:
  
  Added connections and protection diodes for two PowerFilm MPT3.6-150 solar panels
  Replaced GlobalTop FGPMMOPA6H GPS with u-blox SAM-M8Q
  Added split pad to select LTC3225EDDB output voltage. Default is now 5.3V
  Replaced R2 with 30K to set supercapacitor charge current to 60mA
  LTC3225EDDB is now powered from VBUS instead of VBAT
  R3+R6 now monitor VBUS instead of VBAT
  Added reset supervisor U1
- V4:
  
  Power: 3 x AA batteries in Keystone 92 clips
  GNSS: u-blox MAX-M8Q with SMA antenna
  SMA antenna for 9603N
  Added WS2812B LED
  Added LT1634-1,25BMCMS8 voltage reference to allow low battery voltages to be measured
  Added protection diode for USB power
  Added split pad to select supercapacitor charge current
- V5:
  
  Added a dual coil latching DPDT relay (Omron G6SK-2 3VDC; enabled via D2 and D7)
  Solar pins have been moved to make room for the relay
  Isolated the Iridium antenna ground
  9603N EXT_PWR is now switched via Q4 and Q5 (enabled via A5/D19)
  Added a pull-down resistor for LTC3225 ~SHDN
  R1 now pulls up (not down)
  A3 now connects to 9603N Ring Indicator (not Network Available)
  Added a pad for an external reset switch
  Added a pad for a battery power switch

## Sheet 8 of 8
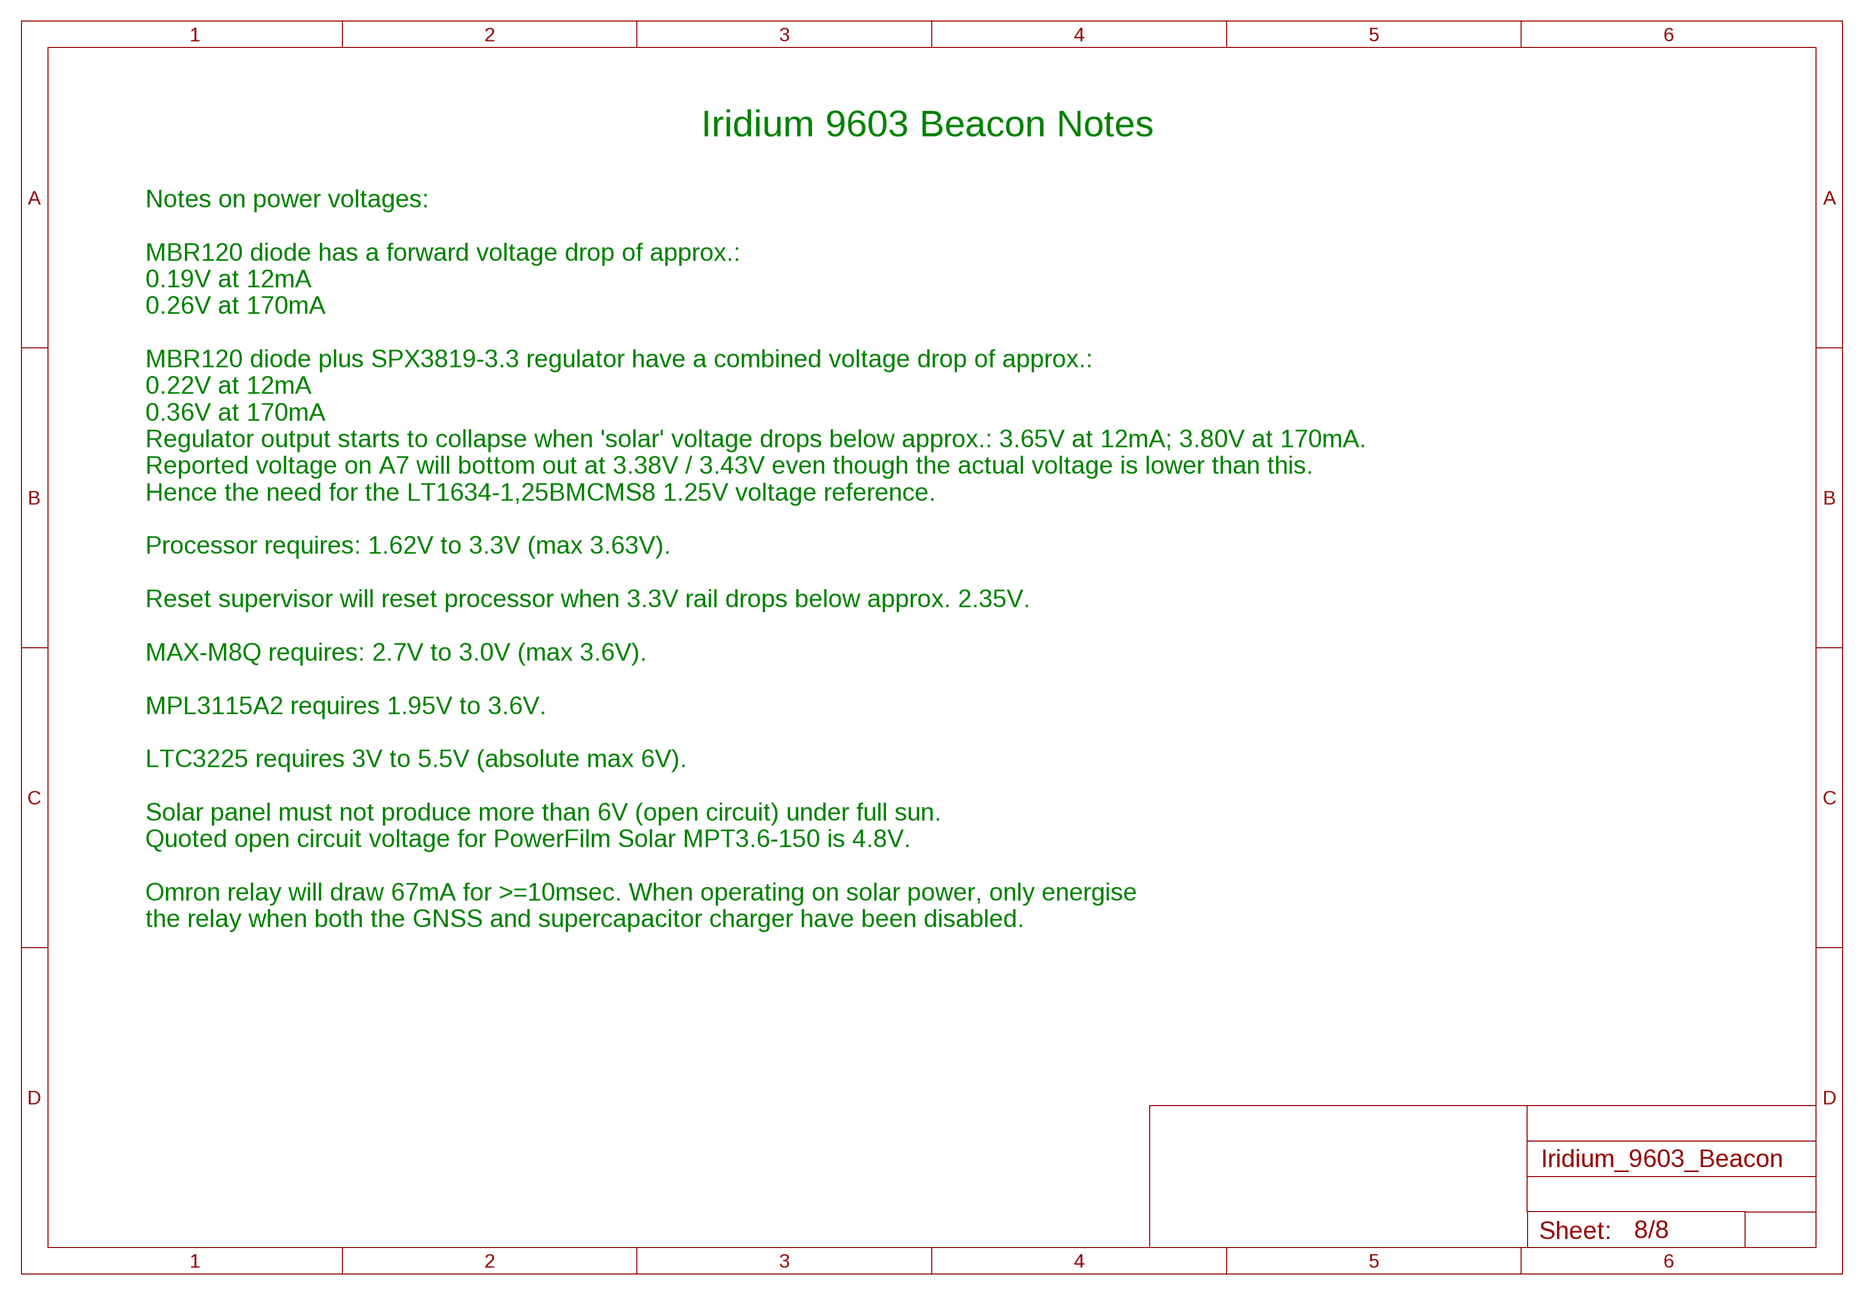
[diagram p7: schematic, sheet 8]

### Notes on the sheet
- Iridium 9603 Beacon Notes
- Notes on power voltages:
  
  MBR120 diode has a forward voltage drop of approx.:
  0.19V at 12mA
  0.26V at 170mA
  
  MBR120 diode plus SPX3819-3.3 regulator have a combined voltage drop of approx.:
  0.22V at 12mA
  0.36V at 170mA
  Regulator output starts to collapse when 'solar' voltage drops below approx.: 3.65V at 12mA; 3.80V at 170mA.
  Reported voltage on A7 will bottom out at 3.38V / 3.43V even though the actual voltage is lower than this.
  Hence the need for the LT1634-1,25BMCMS8 1.25V voltage reference.
  
  Processor requires: 1.62V to 3.3V (max 3.63V).
  
  Reset supervisor will reset processor when 3.3V rail drops below approx. 2.35V.
  
  MAX-M8Q requires: 2.7V to 3.0V (max 3.6V).
  
  MPL3115A2 requires 1.95V to 3.6V.
  
  LTC3225 requires 3V to 5.5V (absolute max 6V). 
  
  Solar panel must not produce more than 6V (open circuit) under full sun.
  Quoted open circuit voltage for PowerFilm Solar MPT3.6-150 is 4.8V.
  
  Omron relay will draw 67mA for >=10msec. When operating on solar power, only energise
  the relay when both the GNSS and supercapacitor charger have been disabled.

## Power pins joined to a net without a drawn wire
9_V_RESET_N: U6.9_RESET_N(9_V_RESET_N)

## Library data of the parts
3V3 3V3SW BAT- COM1 COM2 CS GND GND2 GND3 MISO MOSI NC1 NC2 NO1 NO2 RST SCK SCL SDA SOLAR1+ SOLAR1- SOLAR2+ SOLAR2- SWCLK SWDIO VBUS = adafruit:PINHD-1X1: Pin header 1x1 for 0.1" spacing With round pins
BAT1-BAT3 = SparkFun-Electromechanical:BATTERY: Battery Holders Various common sizes : AA, AAA, 18650 (PRT-12895), 20mm coin cell and 12mm coin cell. 20MM_4LEGS, BATT-10373
C1-C10 C13-C19 = microbuilder:CAP_CERAMIC: Ceramic Capacitors For new designs, use the packages preceded by an '_' character since they are more reliable: The following footprints should be used on most boards: _0402 - Standard footprint for regular board layouts _0603 - Standard footprint for regular board layouts _0805 - Standard footprint for regular board layouts _1206 - Standard footprint for regular board layouts For extremely tight-pitch boards where space is at a premium, the following 'micro-pitch' footprints can be used (smaller pads, no silkscreen outline, etc.): _0402MP - Micro-pitch footprint for very dense/compact boards _0603MP - Micro-pitch footprint for very dense/compact boards _0805MP - Micro-pitch footprint for very dense/compact boards _1206MP - Micro-pitch footprint for very dense/compact boards
C11 C12 = SparkFun-Capacitors:1F-2.7V(PTH): CAP-08070
CON1 = Iridium_9603_Beacon:MICROBUILDER_USB: USB Connectors USBMINIB - Surface Mount Female Mini-B USB Connector 4UConnector: 06564
CON4 = microbuilder:ANTENNA_U.FL: U.FL Antenna Connector
D1-D6 = microbuilder:DIODE-SCHOTTKY
FD1 FD2 = SparkFun-Aesthetics:FIDUCIAL: Fiducial Alignment Points Various fiducial points for machine vision alignment.
GNSS IRIDIUM = con-coax:SMA-: SMA 50 Ohm End Launch Jack Receptacle - Round Contact Johnson Components Source: www.johnsoncomponents.com .. J502-ND.pdf; MF: JOHNSON COMPONENTS; MPN: 142-0711-821; OC_FARNELL: 1019328; OC_NEWARK: 16F3627
J1 = SS4-10-3.50-X-D:SS4-10-3.50-X-D: 0.4mm[.016] SOCKET STRIP ASSEMBLY.
JP1 JP2 = SparkFun-Passives:JUMPER-PAD-3-2OF3_NC_BY_TRACE
L1 = microbuilder:FERRITE: Ferrite Bead 0603 MMZ1608B121C - 120 Ohm @ 100MHz, 600mA, 0.15 Ohm DC Resistance - Digikey: 445-2164-1-ND BK1608HW121-T - 120 Ohm, 600mA Ferrite Chip - Digikey: 587-1876-2-ND 0805 HZ0805B272R-10 - 2.7K Ohm @ 100MHz, 200mA, 0.8 Ohm DC Resistance - Digikey: 240-2504-1-ND (see also Murata BLM21BD272SN1L) MMZ2012Y152B - 1.5K Ohm @ 100MHz, 500mA, 0.4 Ohm DC Resistance - Digikey: 445-1560-1-ND - Mainly for high frequency (80-400MHz) MMZ2012R102A - 1K Ohm @ 100MHz, 500mA, 0.3 Ohm DC Resistance - Digikey: 445-1555-2-ND - More general purpose (10-200MHz)
LED1 = SparkFun-LED:WS2812B: WS2812B - Intelligent control LED integrated light source Technical Specifications: Power Supply Voltage (VDD): 3.5 to 5.3 V Input Voltage (VI): -0.5 to VDD+0.5 V Operating Junction Temperature (Topt): -25°C to +80°C Storage Temperature Range (Tstg): -55°C to +150°C; PROD_ID: DIO-12503
LED2 = microbuilder:LED: LED 0603 - 0603 Surface Mount Package 2mA: Green LED - Low Power (3.9mcd, 2ma, 1.7Vf) - Digikey: 475-2709-2-ND Orange LED - Low Power (9.8mcd, 2ma, 1.8Vf) - Digikey: 475-1194-2-ND Red LED - Low Power (5mcd, 2ma, 1.8Vf) - Digikey: 475-1195-2-ND Yellow LED - Low Power (7mcd, 2ma, 1.8Vf) - Digikey: 475-1196-2-ND 5mA: Blue LED - Low Power (17mcd, 5ma, 2.9Vf) - Digikey: LNJ937W8CRACT-ND 0805 - 0805 Surface Mount Package 2mA: Red LED (8.8mcd, 2mA, 1.8Vf, Clear) - Low Power [Digikey: 475-2510-1-ND] Green LED (5mcd, 2mA, 1.8Vf, Clear) - Low Power [Digikey: 475-2730-1-ND] Yellow LED (11.3mcd, 2mA, 1.8Vf, Clear) - Low Power [Digikey: 475-2555-1-ND] 20mA: Red LED (104mcd, 20mA, Diffused) - LS R976 [Digikey: 475-1278-6-ND] Red LED (12mcd, 20mA, 2.0Vf, Clear) - APT2012EC [Digikey: 754-1128-1-ND] Green LED (15mcd, 20mA, 2.2Vf, Clear) - APT2012GC [Digikey: 754-1131-1-ND] Orange LED (160mcd, 20mA, 2.1Vf, Clear) - APT2012SECK [Digikey: 754-1130-1-ND] 1206 - 1206 Surface Mount Package Green LED (26mcd, 20mA, Diffused) - LG N971 [Digikey: 475-1407-6-ND] Red LED (15mcd, 20mA, Diffused) - LH N974 [Digikey: 475-1416-6-ND] Cree - Cree High-Power Surface Mount LEDs XPEBWT-L1-0000-00D50 - White 111lm 350mA 2.9Vf 6200K 110° XTEAWT-00-0000-00000LEE3 - White 114lm 350mA 2.85Vf 5000K 115° Everlight - Everlight 45-21 Series Surface Mount LEDs 45-21/QK2C-B2832AC2CB2/2T - Warm White 2000mcd 20mA 3.25Vf 3050K 120° 45-21/LK2C-B38452C4CB2/2T - Nuetral White 2000mcd 20mA 3.25Vf 4150K 120° 45-21/LK2C-B50634C6CB2/2T - Cold White 2200mcd 20mA 3.25Vf 5650K 120° PLCC2 Reverse Mount LS T77K-J1L2-1-0-2-R18-Z - Red 11.25mcd 2mA 1.8Vf 630nm 120° LO T77K-L1M2-24-Z - Orange 19.6mcd 2mA 1.8Vf 606nm 120° LY T77K-K2M1-26-Z - Yellow 15.7mcd 2mA 1.8Vf 587nm 120°
Q1-Q4 = microbuilder:MOSFET-P: P-Channel Mosfet LEGEND VDS: Voltage Drain-Source ID: Drain Current RDS(ON): Drain-Source On-State Resistance VGS(TH): Gate-Source Threshold Voltage CISS: Drain-Source Input Capacitance SOT-23 Name VDS ID RDS(ON) VGS(TH) CISS Order Number IRLML5103 30V 760mA 600 mOhm -- 75pF @ 25V Digikey: IRLML5103PBFCT-ND IRLML6401 12V 4.3A 50 mOhm 950mV @ 250µA 830pF @ 10V Digikey: IRLML6401PBFTR-ND NTR0202PL 20V 400mA 800 mOhm 2.3V @ 250uA 70pF @ 5V Digikey: NTR0202PLT1GOSTR-ND NTR4101PT1G 20V 1.8A 85 mOhm 1.2V @ 250uA 675pF @ 10V Digikey: NTR4101PT1GOSCT-ND DMP2004K 20V 600mA 900 mOhm 1V @ 250uA 175pF @ 16V Digikey: DMP2004KDICT-ND PMV65XP 20V 3.9A 76 mOhm 950mV @ 1mA 725pF @ 20V Digikey: 568-2358-2-ND TO-252 Name VDS ID RDS(ON) VGS(TH) CISS Order Number AOD417 30V 25A 34 mOhm 3V @ 250µA 920pF @ 15V Digikey: 785-1106-2-ND
Q5 = transistor:*-NPN-: NPN Transistror BF959 corrected 2008.03.06
R1-R17 = microbuilder:RESISTOR: Resistors For new designs, use the packages preceded by an '_' character since they are more reliable: The following footprints should be used on most boards: _0402 - Standard footprint for regular board layouts _0603 - Standard footprint for regular board layouts _0805 - Standard footprint for regular board layouts _1206 - Standard footprint for regular board layouts For extremely tight-pitch boards where space is at a premium, the following 'micro-pitch' footprints can be used (smaller pads, no silkscreen outline, etc.): _0402MP - Micro-pitch footprint for very dense/compact boards _0603MP - Micro-pitch footprint for very dense/compact boards _0805MP - Micro-pitch footprint for very dense/compact boards _1206MP - Micro-pitch footprint for very dense/compact boards
RELAY1 = G6SK-2_DC5:G6SK-2_DC5: RELAY TELECOM DPDT 2A 5V Source: Datasheet <http://omronfs.omron.com/en_US/ecb/products/pdf/en-g6s.pdf>; DESCRIPTION: RELAY TELECOM DPDT 2A 5V; HEIGHT: 9mm; MANUFACTURER_NAME: Omron Electronics; MANUFACTURER_PART_NUMBER: G6SK-2 DC5
S1 S2 = SparkFun-Electromechanical:STANDOFF_ELECTRICAL: A standoff intended to be an electrically connected point.
SW1 = SparkFun-Electromechanical:SWITCH_SPST_4_PIN; PROD_ID: SWCH-13065
U1 = Microchip-MCP11:MCP11: Micropower Voltage Detector ,SOT23-3;; MPN: MCP111T-240E/TT; OC_FARNELL: 1851877; OC_NEWARK: 56J7328; PACKAGE: SOT23-3; SUPPLIER: MICROCHIP
U2 = microbuilder:VREG_SOT23-5: SOT23-5 Fixed Voltage Regulators Part Current Out V Out V In V Dropout θJA (°C/W) TJ (°C) Digikey Part No. ADP121 150mA 3.3V 3.4-5.5V 0.09V @ 150mA -- -- ADP121-AUJZ33R7CT-ND ADP121 150mA 3.0V 3.1-5.5V 0.09V @ 150mA -- -- ADP121-AUJZ30R7CT-ND ADP122 300mA 3.3V 3.4-5.5V 0.085V @ 300mA -- -- ADP122AUJZ-3.3-R7CT-ND ADP1712 300mA 3.3V 3.5-5.5V 0.17V @ 300mA -- -- ADP1712AUJZ-3.3-R7TR-ND AP7311 (Low Cost) 150mA 3.3V 3.5-6V 0.15V @ 150mA -- -- AP7311-33WG-7DICT-ND LD39015M18R 150mA 1.8V 1.9V-5.5V 0.08V @ 100mA -- -- 497-6977-1-ND LP2985A-33DBVR 150mA 3.3V 3.3-16V 0.28V @ 150mA 206 150 296-18479-1-ND MCP1824T-3302E/OT 300mA 3.3V 3.5V-6V 0.2V @ 300mA -- -- MCP1824T-3302E/OTCT-ND MIC5205-2.5YM5 TR 150mA 2.5V 2.7-16V 0.165V @ 150mA -- -- 576-1257-2-ND MIC5205-3.0YM5 TR 150mA 3.0V 3.2V-16V 0.165V @ 150mA -- -- 576-1258-2-ND MIC5205-3.3YM5 TR 150mA 3.3V 3.5V-16V 0.165V @ 150mA -- -- 576-1259-2-ND TPS780330220 150mA 3.3V+2.2V 3.6-5.5V 250mV Max -- -- 296-23332-1-ND TDA3663/N1,135 100mA 3.3V 3.5-45V 0.18V @ 50mA -- -- 568-5343-1-ND Max operating temp can be calculated using θJA, TJ (max junction temperature), and power in watts. Set the "Maximum Ambient Temperature" until it reaches TJ ("Max Junction Temperature"), which is the absolute limit for safe use of the regulator: Heat Sink Temperature Calculator <http://www.daycounter.com/Calculators/Heat-Sink-Temperature-Calculator.phtml> For example, With 12V source into a 3.3V LP2985 and a 30mA load, we are dissipating (12V-3.3V) * 0.03A = 0.261W. With a θJA of 206 °C/W, a TJ of 150°C, and 261mW we can safely use the chip without a heat sink up to 75°C (=147.1°C Junction Temperature).
U3 = LTC_By_element14_Batch_1:LTC3225EDDB-TRMPBF: 150mA Supercapacitor Charger
U4 = SparkFun-Sensors:MPL3115A2: Altimeter/Pressure Sensor, I2C, 1.95V-3.6V supply, 50 to 110kPa; PROD_ID: IC-10869
U5 = microbuilder:ATSAMD21J
U6 = ubloxLib:MAX-M8: u-blox MAX GNSS module
U7 = linear-technology:LT1634: Micropower Precision Shunt Voltage Reference Source: Darta sheet <http://cds.linear.com/docs/en/datasheet/1634fe.pdf>
X1 = adafruit2:XTAL: Low cost SMT crystals, no capacitors included http://www.ladyada.net/library/eagle

## Board
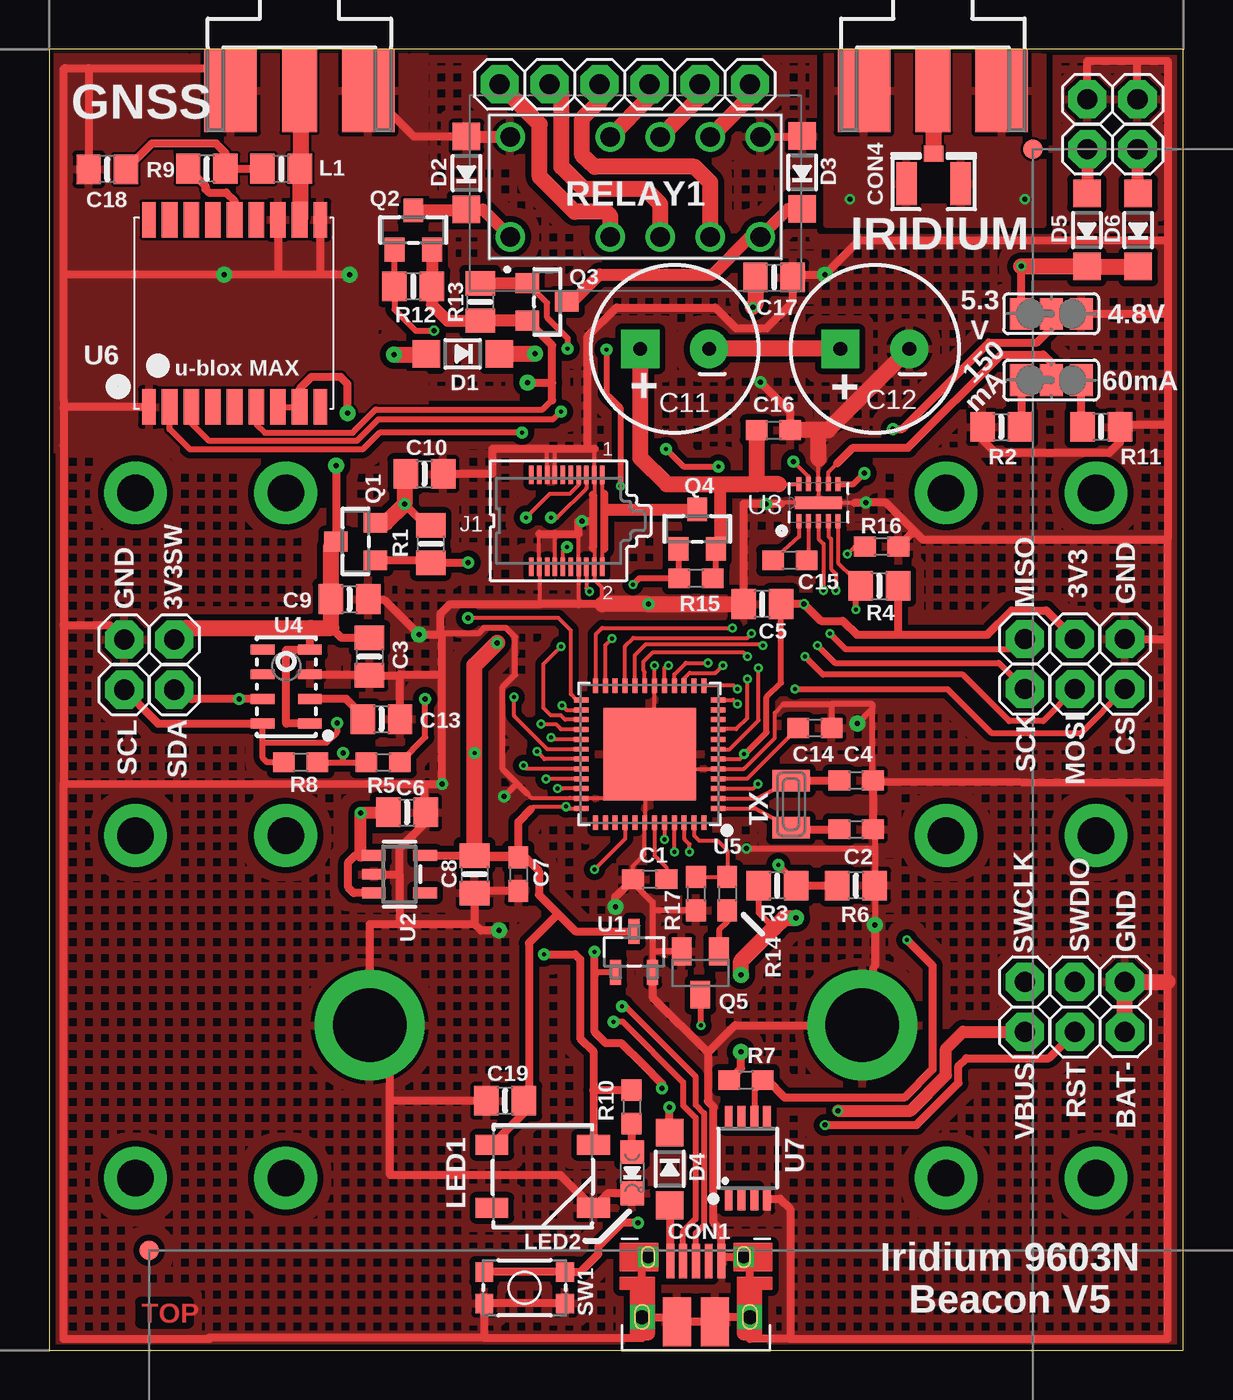
[diagram p8: board, top side]
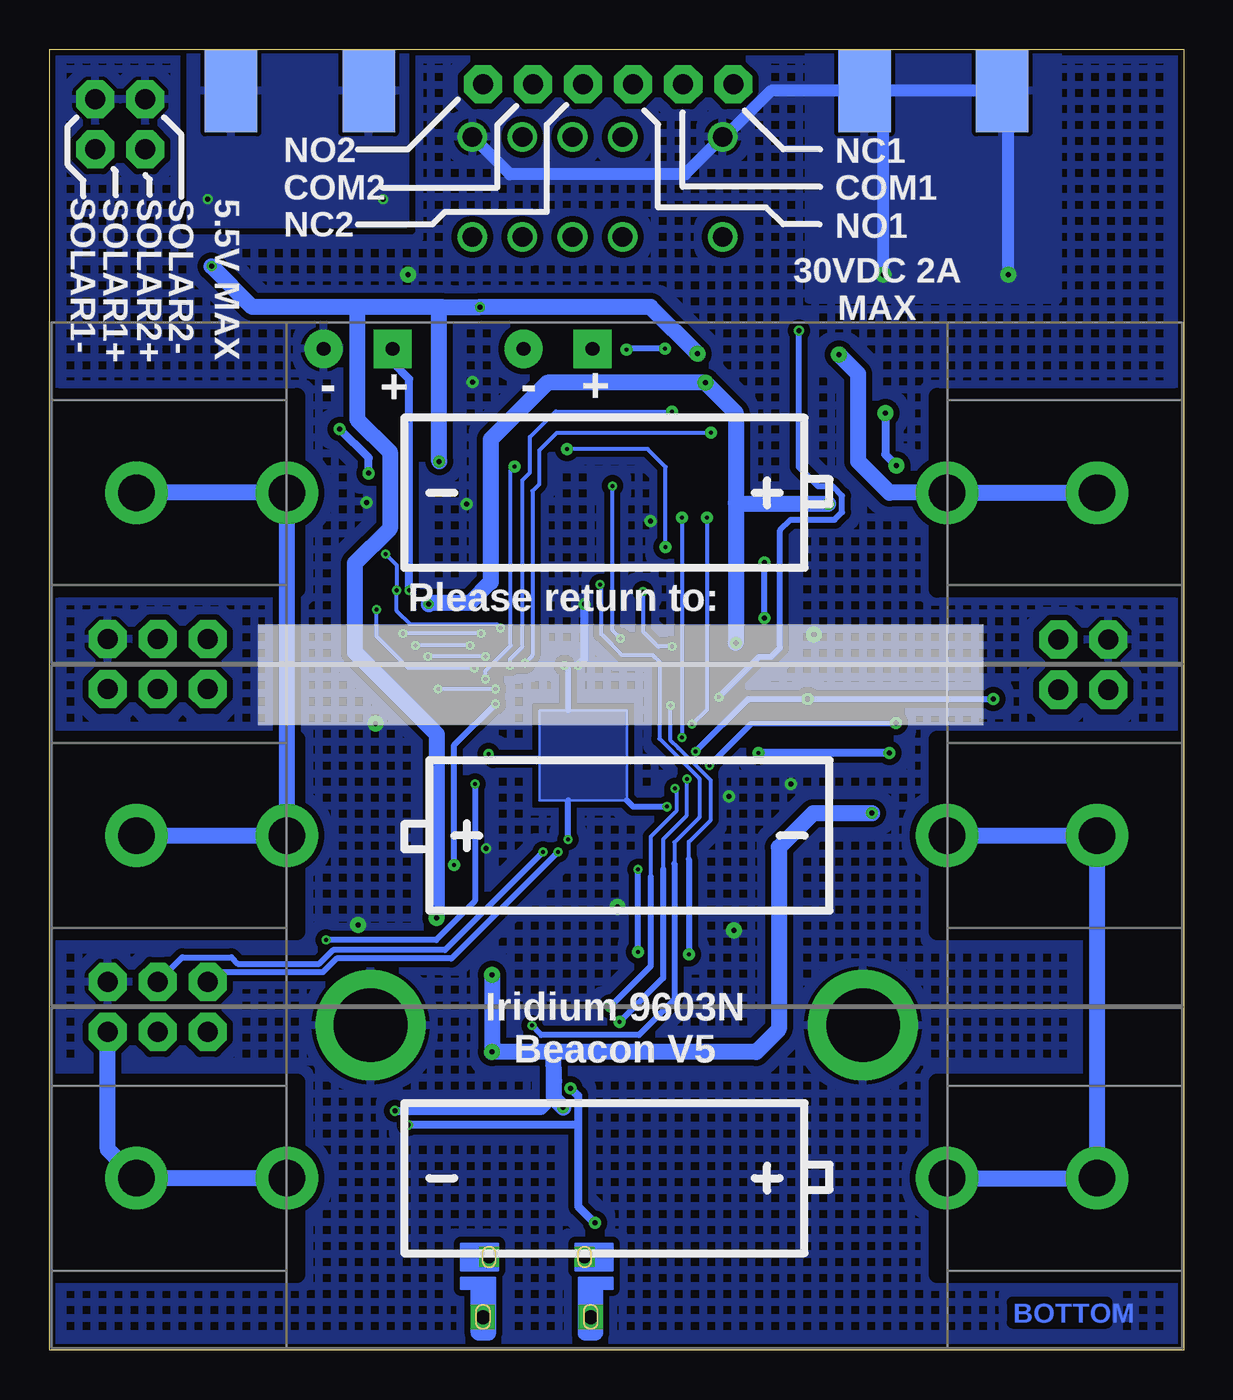
[diagram p9: board, bottom side, seen from below]

Size 57.56 x 66.04 mm. Coordinates in mm from the lower left corner, seen from the top.
Outline: 0,0 57.56,0 57.56,66.04 0,66.04 0,0
Copper layers (1*16): Top 0.018mm / dielectric 1.55mm / Bottom 0.018mm
Design rules "Multi-CB_2L_125um-Tracks_OL35um *": minimum track width 0.125mm, minimum drill 0.2mm, track to track 0.125mm, track to pad 0.125mm, pad to pad 0.125mm, via to via 0.125mm, smd to smd 0mil, copper to edge 0.2mm, drill to drill 0.2mm, minimum pad ring 0.125mm, minimum via ring 0.125mm, stop-mask expansion 2mil, vias tented up to drill 0.45mm, thermal gap 0.2mm

### Footprints (pad centres in the part's own frame; a part is rotated, then mirrored left to right if it is on the bottom)
1X01 = drill 1.016 pad 1.93 octagon: 1 0,0
BATTERY-AAA-KEYSTONE92 = drill 1.854 pad 3.175: GND@1 24.384,0; GND@2 16.764,0; PWR@1 -24.384,0; PWR@2 -16.764,0
0603-NO = smd 1.1 x 1: 1 -0.85,0; 2 0.85,0
0805-NO = smd 1.24 x 1.5: 1 -0.95,0; 2 0.95,0
CPOL-RADIAL-1F-2.7V = drill 0.7 pad 1.93 square: + 1.75,0 | drill 0.7 pad 1.93: - -1.75,0
MICROBUILDER_FCI_10103594_CORRECTED = smd 1.425 x 2.5: BASE@1 -0.963,1.45; BASE@2 0.963,1.45 | smd 0.4 x 1.75: D+ 0,4.525; D- -0.65,4.525; GND 1.3,4.525; ID 0.65,4.525; VBUS -1.3,4.525 | drill 0.7 pad 1.25 square: SPRT@1 -2.736,1.679; SPRT@2 2.736,1.679 | drill 0.65 pad 1.016 square: SPRT@3 -2.426,4.747; SPRT@4 2.426,4.747
U.FL = smd 2.2 x 1.05: 1 0,1.375; 2 0,-1.375 | smd 0.8 x 1: 3 1.525,0
SOD-123 = smd 1.4 x 1.4: A 1.85,0; C -1.85,0
FIDUCIAL-1X2 = smd 1 x 1: 1 0,0
J502-ND-142-0711-821/826 = smd 4.191 x 1.778: 1 2.115,0 | smd 4.191 x 2.667: G@1 2.115,3.495; G@2 2.115,-3.495 | smd 4.191 x 2.667 bottom: G@3 2.115,3.495; G@4 2.115,-3.495
SS4-10-3.50-X-D = smd 0.23 x 0.93: 1 1.8,2.335; 2 1.8,-2.335; 3 1.4,2.335; 4 1.4,-2.335; 5 1,2.335; 6 1,-2.335; 7 0.6,2.335; 8 0.6,-2.335; 9 0.2,2.335; 10 0.2,-2.335; 11 -0.2,2.335; 12 -0.2,-2.335; 13 -0.6,2.335; 14 -0.6,-2.335; 15 -1,2.335; 16 -1,-2.335; 17 -1.4,2.335; 18 -1.4,-2.335; 19 -1.8,2.335; 20 -1.8,-2.335
PAD-JUMPER-3-2OF3_NC_BY_TRACE_YES_SILK_LARGE = smd 1.168 x 1.6: 1 -1.524,0; 2 0,0; 3 1.524,0
WS2812B = smd 1.651 x 1: 1 -2.577,1.6; 2 -2.577,-1.6; 3 2.577,-1.6; 4 2.577,1.6
CHIPLED_0805_NOOUTLINE = smd 1.2 x 1.2: A 0,-1.05; C 0,1.05
SOT23-WIDE = smd 1 x 1.2: 1 -0.95,-1; 2 0.95,-1; 3 0,1
SOT23-BEC = smd 1 x 1.4: B -0.95,-1.1; C 0,1.1; E 0.95,-1.1
G6SK2DC5 = drill 1 pad 1.5: 1 -6.35,-2.54; 3 -1.27,-2.54; 4 1.27,-2.54; 5 3.81,-2.54; 6 6.35,-2.54; 7 6.35,2.54; 8 3.81,2.54; 9 1.27,2.54; 10 -1.27,2.54; 12 -6.35,2.54
STANDOFF-ELECTRICAL-MCMASTER-95117A411 = drill 3.734 pad 5.588: P1 0,0
TACTILE_SWITCH_SMD_4.6X2.8MM = smd 0.9 x 1: 1 -2.05,-0.8; 2 2.05,-0.8; 3 2.05,0.8; 4 -2.05,0.8
SOT95P237X112-3N = smd 0.559 x 1.27: 1 -0.94,-1.041; 2 0.94,-1.041; 3 0,1.041
SOT23-5 = smd 0.55 x 1.2: 1 -0.95,-1.3; 2 0,-1.3; 3 0.95,-1.3; 4 0.95,1.3; 5 -0.95,1.3
DFN300X200-10L = smd 0.711 x 0.254: 1 -0.94,0.991; 2 -0.94,0.508; 3 -0.94,0; 4 -0.94,-0.508; 5 -0.94,-0.991; 6 0.94,-0.991; 7 0.94,-0.508; 8 0.94,0; 9 0.94,0.508; 10 0.94,0.991 | smd 0.635 x 2.388: 11 0,0
LGA8 = smd 1.2 x 0.5: 1 -1.2,1.875; 2 -1.2,0.625; 3 -1.2,-0.625; 4 -1.2,-1.875; 5 1.2,-1.875; 6 1.2,-0.625; 7 1.2,0.625; 8 1.2,1.875
TQFN48_7MM = smd 0.25 x 0.75: 1 -2.75,-3.475; 2 -2.25,-3.475; 3 -1.75,-3.475; 4 -1.25,-3.475; 5 -0.75,-3.475; 6 -0.25,-3.475; 7 0.25,-3.475; 8 0.75,-3.475; 9 1.25,-3.475; 10 1.75,-3.475; 11 2.25,-3.475; 12 2.75,-3.475; 25 2.75,3.475; 26 2.25,3.475; 27 1.75,3.475; 28 1.25,3.475; 29 0.75,3.475; 30 0.25,3.475; 31 -0.25,3.475; 32 -0.75,3.475; 33 -1.25,3.475; 34 -1.75,3.475; 35 -2.25,3.475; 36 -2.75,3.475 | smd 0.75 x 0.25: 13 3.475,-2.75; 14 3.475,-2.25; 15 3.475,-1.75; 16 3.475,-1.25; 17 3.475,-0.75; 18 3.475,-0.25; 19 3.475,0.25; 20 3.475,0.75; 21 3.475,1.25; 22 3.475,1.75; 23 3.475,2.25; 24 3.475,2.75; 37 -3.475,2.75; 38 -3.475,2.25; 39 -3.475,1.75; 40 -3.475,1.25; 41 -3.475,0.75; 42 -3.475,0.25; 43 -3.475,-0.25; 44 -3.475,-0.75; 45 -3.475,-1.25; 46 -3.475,-1.75; 47 -3.475,-2.25; 48 -3.475,-2.75 | smd 4.7 x 4.7: THERMAL 0,0
MAX-M8 = smd 1.8 x 0.7: 1_GND 4.95,-4.4; 9_RESET_N 4.95,4.3; 10_GND -4.55,4.3; 18_SAFEBOOT_N -4.55,-4.4 | smd 1.8 x 0.8: 2_TXD 4.95,-3.35; 3_RXD 4.95,-2.25; 4_TIMEPULSE 4.95,-1.15; 5_EXTINT 4.95,-0.05; 6_V_BCKP 4.95,1.05; 7_VCC_IO 4.95,2.15; 8_VCC 4.95,3.25; 11_RF_IN -4.55,3.25; 12_GND -4.55,2.15; 13_LNA_EN -4.55,1.05; 14_VCC_RF -4.55,-0.05; 15_V_ANT/RESERVED -4.55,-1.15; 16_SDA -4.55,-2.25; 17_SCL -4.55,-3.35
MSOP8 = smd 0.4 x 1.2: 1 -0.975,-2.05; 2 -0.325,-2.05; 3 0.325,-2.05; 4 0.975,-2.05; 5 0.975,2.05; 6 0.325,2.05; 7 -0.325,2.05; 8 -0.975,2.05
XTAL3215 = smd 1.1 x 1.9: P$1 1.2,0; P$2 -1.2,0

### Placement (x,y rotation side)
3V3  52.07,36.1 270 top
3V3SW  6.35,36.07 90 top
BAT1  28.77,43.53 180 bottom
BAT2  28.77,26.13 0 bottom
BAT3  28.77,8.73 180 bottom
BAT-  54.61,16.16 0 top
C1  30.48,23.91 180 top
C2  40.96,26.45 0 top
C3  16.26,35.21 270 top
C4  40.96,28.92 0 top
C5  36.2,37.88 180 top
C6  18.16,27.3 0 top
C7  23.81,24.16 270 top
C8  21.59,24.16 270 top
C9  15.24,38.13 0 top
C10  19.05,44.48 0 top
C11  31.75,50.83 180 top
C12  41.91,50.83 180 top
C13  16.86,32.04 0 top
C14  38.86,31.59 0 top
C15  37.59,40.1 0 top
C16  36.77,46.7 0 top
C17  36.8,54.45 0 top
C18  2.95,59.94 180 top
C19  23.15,12.67 180 top
COM1  25.4,64.26 0 top
COM2  33.02,64.26 0 top
CON1  32.83,0 0 top
CON4  44.89,59.21 90 top
CS  54.61,33.56 90 top
D1  20.99,50.58 180 top
D2  21.18,59.75 90 top
D3  38.23,59.79 90 top
D4  31.5,9.21 270 top
D5  52.67,56.86 90 top
D6  55.28,56.86 90 top
FD1  5.08,5.08 0 top
FD2  49.94,60.96 0 top
GND  54.61,18.7 270 top
GND2  54.61,36.1 270 top
GND3  3.81,36.07 90 top
GNSS  12.7,66.04 270 top
IRIDIUM  44.86,66.04 270 top
J1  26.27,42.1 0 top
JP1  50.86,52.61 180 top
JP2  50.86,49.24 180 top
L1  11.78,59.98 0 top
LED1  25.05,8.83 0 top
LED2  29.59,9.02 180 top
MISO  49.53,36.1 270 top
MOSI  52.07,33.56 90 top
NC1  22.86,64.26 0 top
NC2  30.48,64.26 0 top
NO1  27.94,64.26 0 top
NO2  35.56,64.26 0 top
Q1  15.56,41.05 90 top
Q2  18.48,56.86 0 top
Q3  25.27,53.21 270 top
Q4  32.89,41.69 0 top
Q5  33.05,19.15 180 top
R1  19.37,40.93 270 top
R2  48.32,46.86 0 top
R3  36.96,23.59 180 top
R4  42.13,38.8 0 top
R5  16.95,29.84 0 top
R6  40.96,23.59 180 top
R7  35.37,13.72 0 top
R8  12.76,29.84 180 top
R9  8,59.98 180 top
R10  29.56,12.35 270 top
R11  53.4,46.86 180 top
R12  18.48,54.01 0 top
R13  21.88,53.21 270 top
R14  34.42,23.18 270 top
R15  32.83,39.18 180 top
R16  42.26,40.8 0 top
R17  32.83,23.18 270 top
RELAY1  29.75,59.05 0 top
RST  52.07,16.16 90 top
S1  16.27,16.5 0 top
S2  41.27,16.5 0 top
SCK  49.53,33.56 90 top
SCL  3.81,33.53 270 top
SDA  6.35,33.53 270 top
SOLAR1+  55.24,60.96 0 top
SOLAR1-  55.24,63.5 0 top
SOLAR2+  52.7,60.96 0 top
SOLAR2-  52.7,63.5 0 top
SW1  24.13,3.17 180 top
SWCLK  49.53,18.7 90 top
SWDIO  52.07,18.7 90 top
U1  29.69,20.22 0 top
U2  17.78,24.16 270 top
U3  39.05,43.02 90 top
U4  12.03,33.69 180 top
U5  30.48,30.26 90 top
U6  9.46,52.83 270 top
U7  35.46,9.75 0 top
VBUS  49.53,16.16 90 top
X1  37.66,27.72 270 top

### Tracks (layer width: path | path; a pad name or v marks a point on that pad's centre or on a via)
3V3SW  (via drill 0.25 pad 0.81)
  Top 0.305: U6.7_VCC_IO U6.8_VCC
  Top 0.406: U4.1 12.03,31.81 12.03,35.56 U4.4 13.23,36.63 13.27,36.67 | v15.14,47.56 15.14,49.05 14.8,49.4 13.3,49.4 12.71,48.81 U6.8_VCC | v14.57,44.9 14.57,41.07 Q1.3 | C3.1 14.83,36.16 14.32,36.67
  Top 0.813: Q1.3 14.29,40.78 C9.1 14.32,38.1 14.32,36.67 13.27,36.67 6.95,36.67 3V3SW.1
  Bottom 0.406: v15.14,47.56 15.14,45.47 v14.57,44.9
!RESET  (via drill 0.2 pad 0.46, 0.2 pad 0.61, 0.25, 0.25 pad 0.61)
  Top 0.203: U5.40 29.23,25.96 v27.69,24.42
  Top 0.305: U1.1 27.82,19.18 27.69,19.05
  Top 0.406: SW1.2 SW1.1 26.96,3.98 27.88,4.89 27.88,5.27 29.08,6.48 v29.88,6.48 | v27.69,20.23 27.69,19.05 27.69,16.16 28.26,15.59 29.05,15.59 30.09,14.56 31.11,13.53 v31.11,13.3 | v39.37,11.43 44.02,11.43 46.16,13.57 46.16,14.44 46.55,14.83 50.74,14.83 RST.1
  Bottom 0.305: v27.69,20.23 v27.69,24.42
  Bottom 0.406: v31.11,13.3 30.73,12.92 30.73,11.43 | 30.73,11.43 30.73,7.3 29.91,6.48 v29.88,6.48 | 30.73,11.43 v39.37,11.43
+3V3  (via drill 0.2 pad 0.46, 0.2 pad 0.51, 0.2 pad 0.61, 0.25 pad 0.41, 0.25 pad 0.61, 0.25 pad 0.81)
  Top 0.127: U5.44 31.24,26.77 | 24.45,27.46 24.57,27.59
  Top 0.203: U5.17 31.23,34.63 v31.43,34.77 | 31.24,26.77 v31.24,25.94 | 24.57,27.59 v26.23,27.59 26.31,27.51 U5.36 | C5.1 | U5.6 35.06,30.01 35.27,30.23 v35.27,30.26
  Top 0.305: C5.1 37.15,33.88 36.42,33.15 36.42,31.37 35.31,30.26 v35.27,30.26 | R5.1 R8.1 14.92,29.84 v14.92,30.32 | U6.6_V_BCKP 10.51,47.02 10.95,46.58 15.4,46.58 16.57,47.75 25.05,47.75 25.53,48.23
  Top 0.406: 24.45,27.46 23.81,26.83 C7.1 21.59,25.01 C8.1 U2.5 24.07,25.11 24.86,24.32 24.86,23.11 25.83,22.15 | 25.83,22.15 26.71,21.27 U1.3 | 25.83,22.15 24.35,20.67 24.35,12.93 C19.1 24.1,12.05 LED1.1 | Q3.2 25.53,51.01 25.53,49.12 | R1.1 19.12,41.88 v18.03,42.96 | 3V3.1 50.61,37.56 48.86,37.56 47.62,36.32 43.18,36.32 | v24.28,49.12 25.53,49.12 | 25.53,48.23 25.53,49.12 | 43.18,36.32 40.99,36.32 40.29,37.02 39.17,37.02 v38.32,37.88 C5.1 | R4.2 43.08,36.42 43.18,36.32
  Top 0.61: Q2.2 R12.2 19.43,53.06 20.22,52.26 R13.2 Q3.2
  Top 0.813: C8.1 v21.59,30.32 21.59,34.77 v22.73,35.91 | Q1.2 17.08,42 v18.03,42.96 18.03,44.42 C10.1
  Bottom 0.127: 28.26,27.91 31.24,27.91 32.7,27.91 32.7,30 32.7,32.48 31.24,32.48 28.26,32.48 28.26,27.91
  Bottom 0.305: 32.7,30 35.05,30 35.27,30.23 v35.27,30.26 | v31.24,25.94 31.24,27.91 | 28.26,27.91 27.94,27.59 v26.23,27.59 | v31.43,34.77 31.24,34.58 31.24,32.48
  Bottom 0.406: v14.92,30.32 v21.59,30.32
  Bottom 0.813: v38.32,37.88 38.26,37.94 36.23,37.94 35.18,38.99 35.18,46.23 32.29,49.12 v24.28,49.12 22.73,47.57 22.73,43.02 | 22.73,43.02 v22.73,35.91 | 22.73,43.02 22.67,42.96 v18.03,42.96
  pour Bottom: 28.26,32.48 32.7,32.48 32.7,27.91 28.26,27.91
A0  (via drill 0.2 pad 0.46)
  Top 0.125: 35.8,11.82 U7.6 | 36.17,13.57 R7.2
  Top 0.203: U5.3 35.75,28.51 v35.97,28.73
  Top 0.305: 36.45,13.72 R7.2 | 35.8,11.82 35.8,13.19 36.17,13.57
  Top 0.406: 36.45,13.72 37.34,12.82 43.41,12.82 44.84,14.26 44.83,19.53 v43.53,20.83
  Bottom 0.305: v35.97,28.73 35.97,22.8 37.94,20.83 v43.53,20.83
A1  (via drill 0.2 pad 0.46)
  Top 0.203: U3.5 40.04,39.97 40.77,39.24 40.96,39.24 41.18,39.02 R4.1 | U5.7 34.54,30.51 36.01,31.97 v36.01,34.64
  Top 0.305: v40.96,37.59 40.96,38.57 R4.1
  Bottom 0.203: v36.01,34.64 39.37,34.64 40.96,36.23 v40.96,37.59
A3  (via drill 0.2 pad 0.46, 0.2 pad 0.61)
  Top 0.127: 33.98,31.53 U5.9
  Top 0.203: 33.98,31.53 34.86,31.53 35.43,32.1 v35.43,34.07 | J1.12 26.07,40.55 v26.29,40.77
  Top 0.305: v31.3,45.75 32.19,44.86 v33.97,44.86
  Bottom 0.203: v31.3,45.75 27.21,45.75 26.29,44.83 v26.29,40.77 | v35.43,34.07 35.43,34.51 34.16,35.78 34.16,44.67 v33.97,44.86
A5
  Top 0.203: U5.47 32.73,26.13 32.99,25.88 33.91,25.88 34.42,25.37 R14.1 R17.1
AREF
  Top 0.203: U5.4 35.43,29.01 C14.1
D0  (via drill 0.2 pad 0.46, 0.2 pad 0.61)
  Top 0.203: U5.16 31.73,34.3 32.32,34.89 v33.43,34.89
  Top 0.305: v24,46.58 16.76,46.58 15.91,45.72 7.14,45.72 6.11,46.75 U6.2_TXD
  Bottom 0.203: v24,46.58 31.81,46.58 32.7,45.69 32.7,43.97 33.05,43.62 33.05,35.27 v33.43,34.89
D1  (via drill 0.2 pad 0.46, 0.2 pad 0.61)
  Top 0.127: 32.23,34.1 U5.15
  Top 0.203: 32.23,34.1 32.51,34.38 33.81,34.38 v34.2,34.77
  Top 0.305: U6.3_RXD 7.21,47.07 8.13,46.15 15.61,46.15 16.7,47.24 25.56,47.24 v25.97,47.66
  Bottom 0.203: v25.97,47.66 31.88,47.66 33.18,46.35 33.18,44.55 33.56,44.16 33.56,35.72 34.2,35.08 v34.2,34.77
D2  (via drill 0.2 pad 0.46, 0.2 pad 0.61)
  Top 0.203: U5.23 28.23,35.79 v28.57,36.13
  Top 0.305: Q3.1 25.27,53.16 25.27,52.42 26.32,51.37 v26.32,50.83 | v28.29,50.8 28.29,48.55 28.48,48.35 28.99,47.85 v28.99,43.88
  Top 0.61: R13.1 Q3.1
  Bottom 0.203: v28.57,36.13 28.99,36.54 v28.99,43.88
  Bottom 0.305: v26.32,50.83 28.26,50.83 v28.29,50.8
D5  (via drill 0.2 pad 0.46)
  Top 0.127: 27.75,33.75 U5.24
  Top 0.203: U3.4 39.56,41.31 39.69,41.18 39.69,39.66 39.94,39.4 v39.94,38.58 | 27.75,33.75 27.75,36.35 28.07,36.67 v34.67,36.67 | R16.1 40.89,40.8 v40.51,40.42
  Bottom 0.203: v40.51,40.42 39.94,39.85 v39.94,38.58 39.94,37.53 39.27,36.86 34.86,36.86 v34.67,36.67
D6  (via drill 0.2 pad 0.46, 0.2 pad 0.61)
  Top 0.203: J1.5 27.27,43.75 25.78,42.26 v25.46,42.26 | U5.29 25.57,31.01 v25.46,31.11
  Bottom 0.203: v25.46,42.26 v25.46,31.11
D7  (via drill 0.2 pad 0.46, 0.25)
  Top 0.203: U5.30 25.29,30.51 23.6,32.2 v23.6,33.15
  Top 0.305: Q2.1 R12.1 17.53,52.83 18.61,51.75 v19.53,51.75
  Bottom 0.305: v23.6,33.15 21.53,35.21 20.92,35.21 20.48,35.66 20.48,41.62 19.94,42.16 17.72,42.16 17.34,42.55 17.34,43.37 17.81,43.85 18.54,43.85 19.53,44.83 v19.53,51.75
D9  (via drill 0.2 pad 0.46, 0.2 pad 0.61)
  Top 0.203: U5.12 34.72,33.01 v34.92,32.8
  Top 0.305: R3.1 37.91,23.75 v37.02,24.64
  Top 0.406: R3.1 R6.2
  Bottom 0.305: v37.02,24.64 37.02,30.73 v34.92,32.8
D10  (via drill 0.2 pad 0.46)
  Top 0.203: U5.27 26.19,32.01 25.97,32.23 25.46,32.23 25.08,32.61 25.08,34.83 v25.97,35.72 | J1.6 27.27,38.67 v27.43,38.51
  Bottom 0.203: v25.97,35.72 26.67,35.72 27.43,36.48 v27.43,38.51
D11  (via drill 0.25 pad 0.61)
  Top 0.127: U5.25 26.78,33.01
  Top 0.203: 26.78,33.01 26.48,33.31 26.48,36.54 25.84,37.18 v21.27,37.18
  Top 0.406: Q1.1 19.24,40.1 R1.2 v21.27,39.98 v21.27,39.97
  Bottom 0.305: v21.27,37.18 v21.27,39.97
D12  (via drill 0.2 pad 0.46, 0.2 pad 0.61)
  Top 0.127: 26.98,31.53 U5.28
  Top 0.203: v24.96,31.78 25.72,31.78 25.97,31.53 26.98,31.53 | J1.7 26.87,43.92 26.42,43.47 25.4,43.47 v24.19,42.26
  Bottom 0.203: v24.19,42.26 24.19,32.51 24.92,31.78 v24.96,31.78
D13  (via drill 0.2 pad 0.46, 0.2 pad 0.61)
  Top 0.203: v26.04,32.73 26.26,32.51 U5.26
  Top 0.406: 27.63,13.21 LED1.4 | R10.1 27.64,13.2 27.63,13.21 | v25.11,20.1 26.7,20.1 26.96,19.84 26.96,15.84 27.63,15.17 27.63,13.21
  Bottom 0.203: 25.11,24.92 25.11,25.81 24,26.92 24,28.92 25.64,30.57 25.65,30.57 26.04,30.95 v26.04,32.73
  Bottom 0.305: 25.11,24.92 v25.11,20.1
D+  (via drill 0.2 pad 0.46, 0.2 pad 0.61)
  Top 0.203: U5.34 26.06,28.51 v25.81,28.51
  Top 0.305: v29.08,17.46 29.24,17.46 32.83,13.88 32.83,12.45 33.24,12.04 33.24,6.35 32.83,5.94 CON1.D+
  Bottom 0.203: 27.05,24.04 27.05,26.07 25.72,27.4 25.72,28.42 v25.81,28.51
  Bottom 0.305: v29.08,17.46 27.05,19.49 27.05,24.04
D-  (via drill 0.2 pad 0.46, 0.2 pad 0.61)
  Top 0.203: U5.33 25.61,29.01 v25.21,28.99
  Top 0.305: v28.64,16.67 29.11,16.67 32.18,13.6 32.18,12.43 32.81,11.8 32.81,6.67 32.18,6.04 CON1.D-
  Bottom 0.203: 26.42,24.42 26.42,25.94 25.24,27.11 25.24,28.96 v25.21,28.99
  Bottom 0.305: 26.42,24.42 26.42,18.89 v28.64,16.67
EXT_PWR
  Top 0.203: J1.1 28.07,43.52 28.14,43.48 | 28.14,43.48 | 28.14,43.48 28.16,43.47 | 28.16,40.67 28.07,40.61 J1.2
  Top 0.406: 28.16,42.67 28.16,40.67 | 28.16,43.47 28.16,42.67 | 28.38,42.67 28.16,42.67 | 32.64,42.67 Q4.3
  Top 0.61: 28.38,42.67 32.64,42.67
GND  (via drill 0.2 pad 0.46, 0.25, 0.25 pad 0.61, 0.25 pad 0.81)
  Top 0.127: U5.THERMAL 28.23,28.01 | U5.THERMAL 30.23,30.01 | U5.THERMAL 31.23,29.51 | U5.THERMAL 30.73,30.51 | 16.19,38.07 C9.2 | U5.42 | C4.2 41.78,28.92 | J1.15 | J1.18 24.89,39.77 | J1.8 | 37.15,43.02 37.15,42.96 | U5.18
  Top 0.203: 28.23,28.01 U5.35 26.97,28.04 26.42,28.04 26.41,28.05 24.47,28.05 24.26,28.26 | 30.23,30.01 U5.42 | 31.23,29.51 U5.5 35.26,29.51 36.83,31.08 36.83,32.35 37.27,32.8 | 30.73,30.51 U5.18 | C1.2 29.63,24.58 30.23,25.18 U5.42 | J1.15 25.27,45.75 | 24.89,39.77 24.89,37.88 | U3.11 U3.8 39.05,45.24 | U3.11 40.89,43.02 | U3.11 37.15,43.02 | J1.8 26.87,41.43 | U5.18 v30.73,34.77 | J1.8 26.86,37.88 | J1.13 25.67,45.67 25.59,45.75 | J1.18 24.87,41.43 | J1.14 25.67,41.43 | 27.59,43.43 27.67,43.51 J1.3 27.69,44.45 27.69,45.75 | 27.59,40.73 27.67,40.66 J1.4 27.67,39.1 28.04,38.73 28.04,37.91 28.07,37.88
  Top 0.305: 39.71,32.8 C14.2 | 41.78,28.92 41.78,32.58 | 39.71,32.8 41.78,32.8 41.78,32.58 | 37.27,32.8 39.71,32.8 | 23.72,28.8 23.02,29.5 23.02,33.66 23.65,34.29 23.65,36.2 23.18,36.67 22.07,36.67 21.78,36.39 19.94,36.39 | 23.72,28.8 24.26,28.26 | 29.54,23.82 30.63,22.73 30.63,22.29 | 30.63,22.29 30.63,20.32 | 30.63,20.32 U1.2 | 41.78,32.58 v41.02,31.81 | v41.91,21.59 R6.1 41.91,25.4 | C2.2 41.91,26.35 41.91,25.4 | Q5.E 30.7,20.25 30.63,20.32 | R17.2 30.66,22.33 30.63,22.29 | v23.08,28.1 23.72,28.73 23.72,28.8 | v35.4,25.46 41.84,25.46 41.91,25.4
  Top 0.406: 56.77,56.36 56.77,65.44 55.24,65.44 | 56.77,56.36 56.77,52.61 | 56.77,52.61 56.77,46.99 | 56.77,46.99 56.77,41.18 | 0.73,47.85 0.73,48.26 0.73,54.61 | 0.73,47.85 0.72,45.94 0.73,36.8 | 0.73,36.8 0.73,28.77 | U2.2 17.78,24.16 | 17.78,24.16 17.78,21.62 | 17.78,21.62 16.27,21.62 S1.P1 17.3,15.47 17.3,12.7 | C7.2 21.59,23.31 C8.2 21.59,21.62 | 21.59,21.62 17.78,21.62 | C2.2 C4.2 41.87,28.86 56.77,28.83 | C5.2 | C5.2 v30.42,37.88 | 27.69,45.75 27.34,45.75 | 27.34,45.75 25.59,45.75 25.27,45.75 22.48,45.75 22.48,44.48 C10.2 | 40.89,43.02 v41.47,43.02 42.48,43.02 44.02,41.48 | 37.15,42.96 v36.39,42.96 35.24,42.96 C5.2 | 29.54,23.82 C1.2 28.73,23.01 v28.73,22.51 | SW1.4 SW1.3 22.08,0.69 | 19.94,34.31 19.94,36.39 | 17.8,34.31 19.94,34.31 | 0.73,28.77 17.75,28.73 19.05,28.73 | v22.83,21.3 21.91,21.3 21.59,21.62 | 56.77,28.83 56.77,18.7 56.77,0.57 37.62,0.57 | GND3.1 3.08,36.8 0.73,36.8 | 0.73,54.61 0.73,65.02 0.79,65.09 2,65.09 | 2,65.09 C18.2 | 17.3,12.7 17.3,8.89 25.96,8.89 LED1.3 28.37,7.97 LED2.C | v41.91,21.59 41.91,19.49 41.85,19.43 41.85,17.08 S2.P1 34.82,16.5 33.43,15.11 | 22.08,0.69 22.08,0.62 30.09,0.62 CON1.SPRT@1 | 22.08,0.69 22.13,0.64 8.14,0.64 8.14,0.56 0.73,0.56 0.73,28.77 | U4.3 16.2,34.31 C3.2 17.75,34.26 17.8,34.31 | U6.1_GND 0.76,47.88 0.73,47.85 | 2,65.09 8.04,65.09 GNSS.G@2 | 0.73,54.61 v8.89,54.61 11.59,54.61 | v15.24,54.61 13.75,54.61 | 13.75,54.61 11.59,54.61 | U6.12_GND 11.61,54.63 11.59,54.61 | U6.10_GND 13.76,54.62 13.75,54.61 | 56.77,28.83 56.77,36.07 | 56.77,36.07 56.77,41.18 | GND2.1 56.74,36.1 56.77,36.07 | 19.05,28.73 v19.94,28.73 19.94,34.31 | 56.77,41.18 56.74,41.15 44.35,41.15 44.02,41.48
  Top 0.406: C19.2 17.34,12.67 17.3,12.7 | 33.43,15.11 33.43,12.64 33.72,12.35 33.72,6.48 34.13,6.07 CON1.GND 34.13,4.75 CON1.SPRT@4 35.56,4.75 CON1.SPRT@2 | 56.77,46.99 54.48,46.99 R11.1 54.35,46.1 53.82,45.56 48.04,45.56 47.37,46.23 R2.1 | 17.78,24.16 17.78,25.46 19.11,26.79 C6.2 19.05,27.37 19.05,28.73 | C13.2 17.81,34.31 17.8,34.31 | RELAY1.7 38.19,61.59 D3.A | 55.24,65.44 52.7,65.44 SOLAR2-.1 | SOLAR1-.1 55.24,65.44 | JP1.1 56.77,52.61 | 56.77,56.36 41.12,56.36 v39.37,54.61 37.91,54.61 C17.2 37.75,53.21 36.42,51.88 34.86,51.88 33.81,52.93 28.8,52.93 27.34,51.47 27.34,45.75 | U1.2 30.63,17.92 33.43,15.11 | R16.2 43.79,41.48 44.02,41.48 | 24.87,41.43 25.67,41.43 26.87,41.43 26.87,42.1 v27.05,42.1 27.59,42.1 | 28.07,37.88 26.86,37.88 24.89,37.88 20.35,37.88 19.88,37.4 19.88,36.32 v18.76,36.32 17.02,38.07 16.19,38.07 | 27.59,43.43 27.59,42.1 | 27.59,42.1 27.59,40.73 | C16.2 37.62,47.63 v36.1,49.15 | D2.A 18.52,61.6 GNSS.G@3 | U7.4 37.1,7.7 37.62,7.18 37.62,0.57 | 37.62,0.57 35.56,0.57 CON1.SPRT@2 | CON1.SPRT@2 33.79,1.68 CON1.BASE@2 CON1.BASE@1 31.87,1.68 CON1.SPRT@1 | CON1.SPRT@1 30.09,4.75 CON1.SPRT@3
  Top 0.61: D2.A RELAY1.12
  Top 0.813: 39.05,45.24 39.05,46.7 | 39.05,46.7 C16.2 | C5.2 v30.42,37.88 28.07,37.88 | C12.- 39.53,46.7 39.05,46.7 | GND.1 56.77,18.7
  Bottom 0.406: v30.73,34.77 30.42,35.08 v30.42,37.88
  Bottom 0.61: GNSS.G@3 GNSS.G@2 8.89,63.61 v8.89,54.61 | GNSS.G@3 20.94,63.92 23.27,61.59 RELAY1.12 25.3,59.69 34.2,59.69 RELAY1.7 | v15.24,54.61 15.24,62.97 GNSS.G@3
  pour Bottom (isolate 0.305, rank 2, hatched): 0,0 0,66.04 57.56,66.04 57.56,0
  pour Top (isolate 0.305, rank 2, hatched): 0,0 0,66.04 57.56,66.04 57.56,0
  pour Top (isolate 0.102): 0,66.04 19.05,66.04 19.05,58.42 16.51,58.42 16.51,49.53 19.05,49.53 19.05,45.72 0,45.72
  pour Bottom (isolate 0.102): 6.35,66.04 19.05,66.04 19.05,53.34 6.35,53.34
GNDA  (via drill 0.25)
  other vias: 40.64,58.42 49.53,58.42
  pour Bottom (isolate 0.102): 39.5,66.04 50.42,66.04 50.42,57.15 39.5,57.15
  pour Top (isolate 0.102): 39.5,66.04 50.42,66.04 50.42,57.15 39.5,57.15
GPS_ANT
  Top 0.125: 12.75,60.12 L1.2 | 12.75,63.88 GNSS.1
  Top 0.406: 12.73,57.4 U6.11_RF_IN
  Top 0.813: L1.2 12.73,57.4 | 12.75,63.88 12.75,60.12
LTC3225_VOUT
  Top 0.203: 37.03,43.96 U3.10
  Top 0.305: R15.1 33.84,39.34 Q4.2
  Top 0.61: Q4.2 34.04,40.88 34.04,43.96
  Top 0.813: C11.+ 30,45.31 31.35,43.96 34.04,43.96 35.92,43.96 | 35.92,43.96 35.93,43.97 C16.1 | 37.03,43.96 35.92,43.96
MISO  (via drill 0.2 pad 0.46)
  Top 0.203: U5.21 29.23,35.74 29.65,36.16 35.43,36.16 v35.66,36.39
  Top 0.305: v39.62,36.39 40.42,35.59 49.02,35.59 MISO.1
  Bottom 0.203: v35.66,36.39 v39.62,36.39
MOSI  (via drill 0.2 pad 0.46)
  Top 0.203: U5.19 30.23,34.42 30.16,34.54 30.16,34.96 30.62,35.42 35.23,35.42 v35.43,35.21
  Top 0.305: MOSI.1 50.45,31.94 48.74,31.94 46.39,34.29 39.27,34.29 v38.35,35.21
  Bottom 0.203: v35.43,35.21 v38.35,35.21
N$1
  Top 0.406: L1.1 R9.1 8.95,60.77 8.48,61.25 5.21,61.25 C18.1
N$2
  Top 0.125: 44.88,60.75 CON4.3 | 44.88,63.88 IRIDIUM.1
  Top 0.813: 44.88,63.88 44.88,60.75
N$3
  Top 0.406: R10.2 29.56,10.1 LED2.A
N$4
  Top 0.61: SOLAR1+.1 55.24,58.71 D6.A
N$5
  Top 0.203: U5.1 35.84,27.51 X1.P$1
  Top 0.406: X1.P$1 36.96,26.52 36.96,26.45 C2.1
N$6  (via drill 0.2 pad 0.46)
  Top 0.203: U3.3 39.05,41.18 39.31,40.93 v39.31,38.58
  Top 0.813: C12.+ C11.-
  Bottom 0.406: v39.31,38.58 39.31,49.31 40.16,50.16 C12.+
N$7
  Top 0.203: U5.2 35.92,28.01 X1.P$2
  Top 0.406: X1.P$2 39.09,28.92 C4.1
N$8
  Bottom 0.813: BAT1.GND@1 BAT1.GND@2 BAT2.PWR@2 BAT2.PWR@1
N$9
  Top 0.127: 38.54,40.12 C15.2
  Top 0.203: U3.2 38.54,40.12
N$10
  Top 0.203: U3.1 38.06,41.29 C15.1
N$11
  Top 0.203: U3.7 39.56,44.58 40.01,45.02
  Top 0.406: 40.01,45.02 40.8,45.81 43.59,45.81 48.32,50.55 50.45,50.55 50.86,50.13 JP2.2
N$12
  Top 0.406: U4.2 15.08,33.06 15.91,32.23 C13.1
N$13  (via drill 0.25 pad 0.61)
  Top 0.305: U3.6 40.82,43.96 v41.37,44.51
  Top 0.406: JP1.2 50.9,52.58 50.9,51.91 50.13,51.15 47.69,51.15 43.31,46.77 v42.83,46.77
  Bottom 0.406: v41.37,44.51 41.37,45.31 v42.83,46.77
N$14
  Top 0.61: SOLAR2+.1 52.7,58.71 D5.A
N$15
  Top 0.813: BAT-.1 54.61,18.7
  Bottom 0.813: BAT-.1 54.61,10.19 BAT3.GND@1 BAT3.GND@2
N$16
  Top 0.406: CON1.VBUS 31.53,7.32 D4.A
N$17
  Top 0.406: JP2.3 49.34,46.93 R2.2
N$18
  Top 0.406: R11.2 52.39,46.93 JP2.1
N$19  (via drill 0.2, 0.2 pad 0.46)
  Top 0.305: v29.62,38.86 29.94,39.18 R15.2 31.94,39.22 Q4.1 | v33.08,16.48 33.08,18.01 Q5.C
  Bottom 0.203: 25.84,24.7 25.84,25.78 24.57,27.05 24.57,29.02 26.61,31.05 26.61,34.96 26.92,35.27 28.48,35.27 29.56,36.35 29.56,38.8 v29.62,38.86
  Bottom 0.305: 25.84,24.7 25.84,17.81 27.65,16 32.61,16 v33.08,16.48
N$20
  Top 0.305: Q5.B 34,21.33 34,21.34 34.42,21.75 R14.2
N$21
  Bottom 0.813: BAT2.GND@2 BAT2.GND@1 BAT3.PWR@1 BAT3.PWR@2
N$23
  Top 0.813: RELAY1.3 28.48,57.56 28.26,57.78 26.67,57.78 24.89,59.56 24.89,62.23 NC1.1
N$24
  Top 0.813: RELAY1.4 31.02,58.17 30.26,58.93 27.15,58.93 26,60.07 26,63.82 COM1.1
N$25
  Top 0.813: RELAY1.5 33.56,59.28 32.77,60.07 27.69,60.07 27.05,60.67 27.05,62.52 27.94,63.37 NO1.1
N$26
  Top 0.813: RELAY1.8 35.56,63.59 NO2.1
N$27
  Top 0.813: RELAY1.9 33.02,63.59 COM2.1
N$28
  Top 0.813: RELAY1.10 30.48,63.59 NC2.1
RESET_RELAY
  Top 0.61: D3.C 37.52,57.94 RELAY1.6 35.59,56.52 33.69,54.61 27.94,54.61 26.54,53.21 Q3.3
SCK  (via drill 0.2 pad 0.46)
  Top 0.203: U5.20 29.73,35.29 30.28,35.84 36.11,35.84 v36.23,35.78
  Top 0.305: v38.99,35.78 39.88,34.89 48.2,34.89 SCK.1
  Bottom 0.203: v36.23,35.78 v38.99,35.78
SCL  (via drill 0.2 pad 0.46, 0.25 pad 0.61)
  Top 0.203: U5.32 24.25,29.51 v24.07,29.69
  Top 0.305: R8.2 11.05,29.84 10.83,30.06 10.83,30.83 | 10.83,30.83 U4.8 | v14.61,31.84 14.61,31.37 14.06,30.83 10.83,30.83
  Top 0.406: SCL.1 5.53,31.81 U4.8
  Bottom 0.305: v24.07,29.69 21.94,31.81 v14.61,31.84
SD_CS  (via drill 0.2 pad 0.46)
  Top 0.203: v34.92,33.56 34.75,33.73 U5.13
  Top 0.305: v37.85,33.56 45.59,33.56 47.82,31.34 52.39,31.34 CS.1
  Bottom 0.203: v34.92,33.56 v37.85,33.56
SDA  (via drill 0.2 pad 0.46, 0.25 pad 0.61)
  Top 0.203: U5.31 25.14,30.01 v24.77,30.39
  Top 0.305: R5.2 19.08,31.12 v19.08,33.06
  Top 0.406: U4.7 v9.65,33.06 7.25,33.05 6.86,33.05 SDA.1
  Bottom 0.305: v24.77,30.39 22.09,33.06 v19.08,33.06 v9.65,33.06
SET_RELAY
  Top 0.61: RELAY1.1 22.01,57.9 D2.C 21.14,57.86 Q2.3
SWCLK  (via drill 0.2 pad 0.46)
  Top 0.127: 31.75,26.76 U5.45
  Top 0.203: v31.75,25.3 31.75,26.76
  Bottom 0.305: SWCLK.1 49.04,19.19 43.7,19.19 43,19.89 37.17,19.89 v31.75,25.3
SWDIO  (via drill 0.2 pad 0.46)
  Top 0.127: 32.26,26.75 U5.46
  Top 0.203: v32.51,25.3 32.51,25.69 32.26,25.94 32.26,26.75
  Bottom 0.305: SWDIO.1 50.83,19.94 48.33,19.94 48.01,19.62 43.88,19.62 43.18,20.32 37.5,20.32 v32.51,25.3
VBAT  (via drill 0.25 pad 0.81)
  Top 0.813: v17.49,50.55 19.11,50.55 D1.A
  Bottom 0.813: v17.49,50.55 16.51,49.56 16.51,45.12 14.92,43.53 BAT1.PWR@2 BAT1.PWR@1
VBUS  (via drill 0.25, 0.25 pad 0.61, 0.25 pad 0.81)
  Top 0.203: U3.9 38.54,44.35 v37.78,45.12
  Top 0.305: R3.2 36.01,22.22 36.8,21.43
  Top 0.406: U2.1 15.81,25.11 15.52,25.11 15.18,24.77 15.18,23.5 15.46,23.21 U2.3 | R7.1 35.12,14.31 v35.12,15.14 | D4.C v31.5,12.32 | JP1.3 v49.34,55.02
  Top 0.61: 15.81,25.11 v15.81,27.27 17.18,27.27 C6.1 | v40.04,12.16 43.73,12.16 45.53,13.96 45.53,15.3 46.39,16.16 VBUS.1
  Top 0.813: D1.C v24.67,50.58 | v37.91,21.96 37.32,21.96 36.8,21.43 35.12,19.75 v35.12,19.05 | C17.1 35.85,53.09 v35.72,52.96 | v49.34,55.02 52.66,55.02 D5.C D6.C
  Bottom 0.406: v40.04,12.16 32.56,12.16 31.95,12.77
  Bottom 0.813: v15.81,27.27 18.8,27.27 20.54,25.53 20.54,16.29 21.68,15.14 31.97,15.14 | 37.66,52.96 37.81,52.8 37.78,52.77 v37.78,45.12 | 37.66,52.96 v35.72,52.96 27.05,52.96 v24.67,50.58 | v37.91,21.96 37.91,31.27 42.07,35.43 42.07,39.94 40.29,41.72 40.29,45.59 41.94,47.24 41.94,52.96 | 31.97,15.14 v35.12,15.14 v35.12,19.05 | v31.5,12.32 31.95,12.77 31.95,13.65 31.97,15.14 | 37.66,52.96 41.94,52.96 | 41.94,52.96 47.28,52.96 v49.34,55.02
VCC_RF
  Top 0.406: R9.2 7.94,59.09 7.94,58.93 8.1,58.77 8.98,58.77 9.41,58.34 U6.14_VCC_RF
VDDCORE1
  Top 0.127: U5.43
  Top 0.203: U5.43 30.73,25.11 31.33,24.52 C1.1

### Text on the board
Top: TOP
Bottom: BOTTOM
tPlace: 5.3 / V | 4.8V | U6 | 150 | 60mA | + | + | mA | Iridium 9603N / Beacon V5
bPlace: 30VDC 2A / MAX | 5.5V MAX | + | - | + | - | Please return to: | Iridium 9603N / Beacon V5
tNames: GND | GND